# EasyEDA Pro project 电动自行车定位监测终端_v0.0.0.epro

# Schematic Schematic1

## Sheets
1 MCU: Create Date: 2023-08-31; Page Name: MCU; Project Name: 电动自行车定位监测终端; Schematic Name: Schematic1; Update Date: 2023-08-31; Company: 嘉立创EDA; Page Size: A4; Version: V1.0
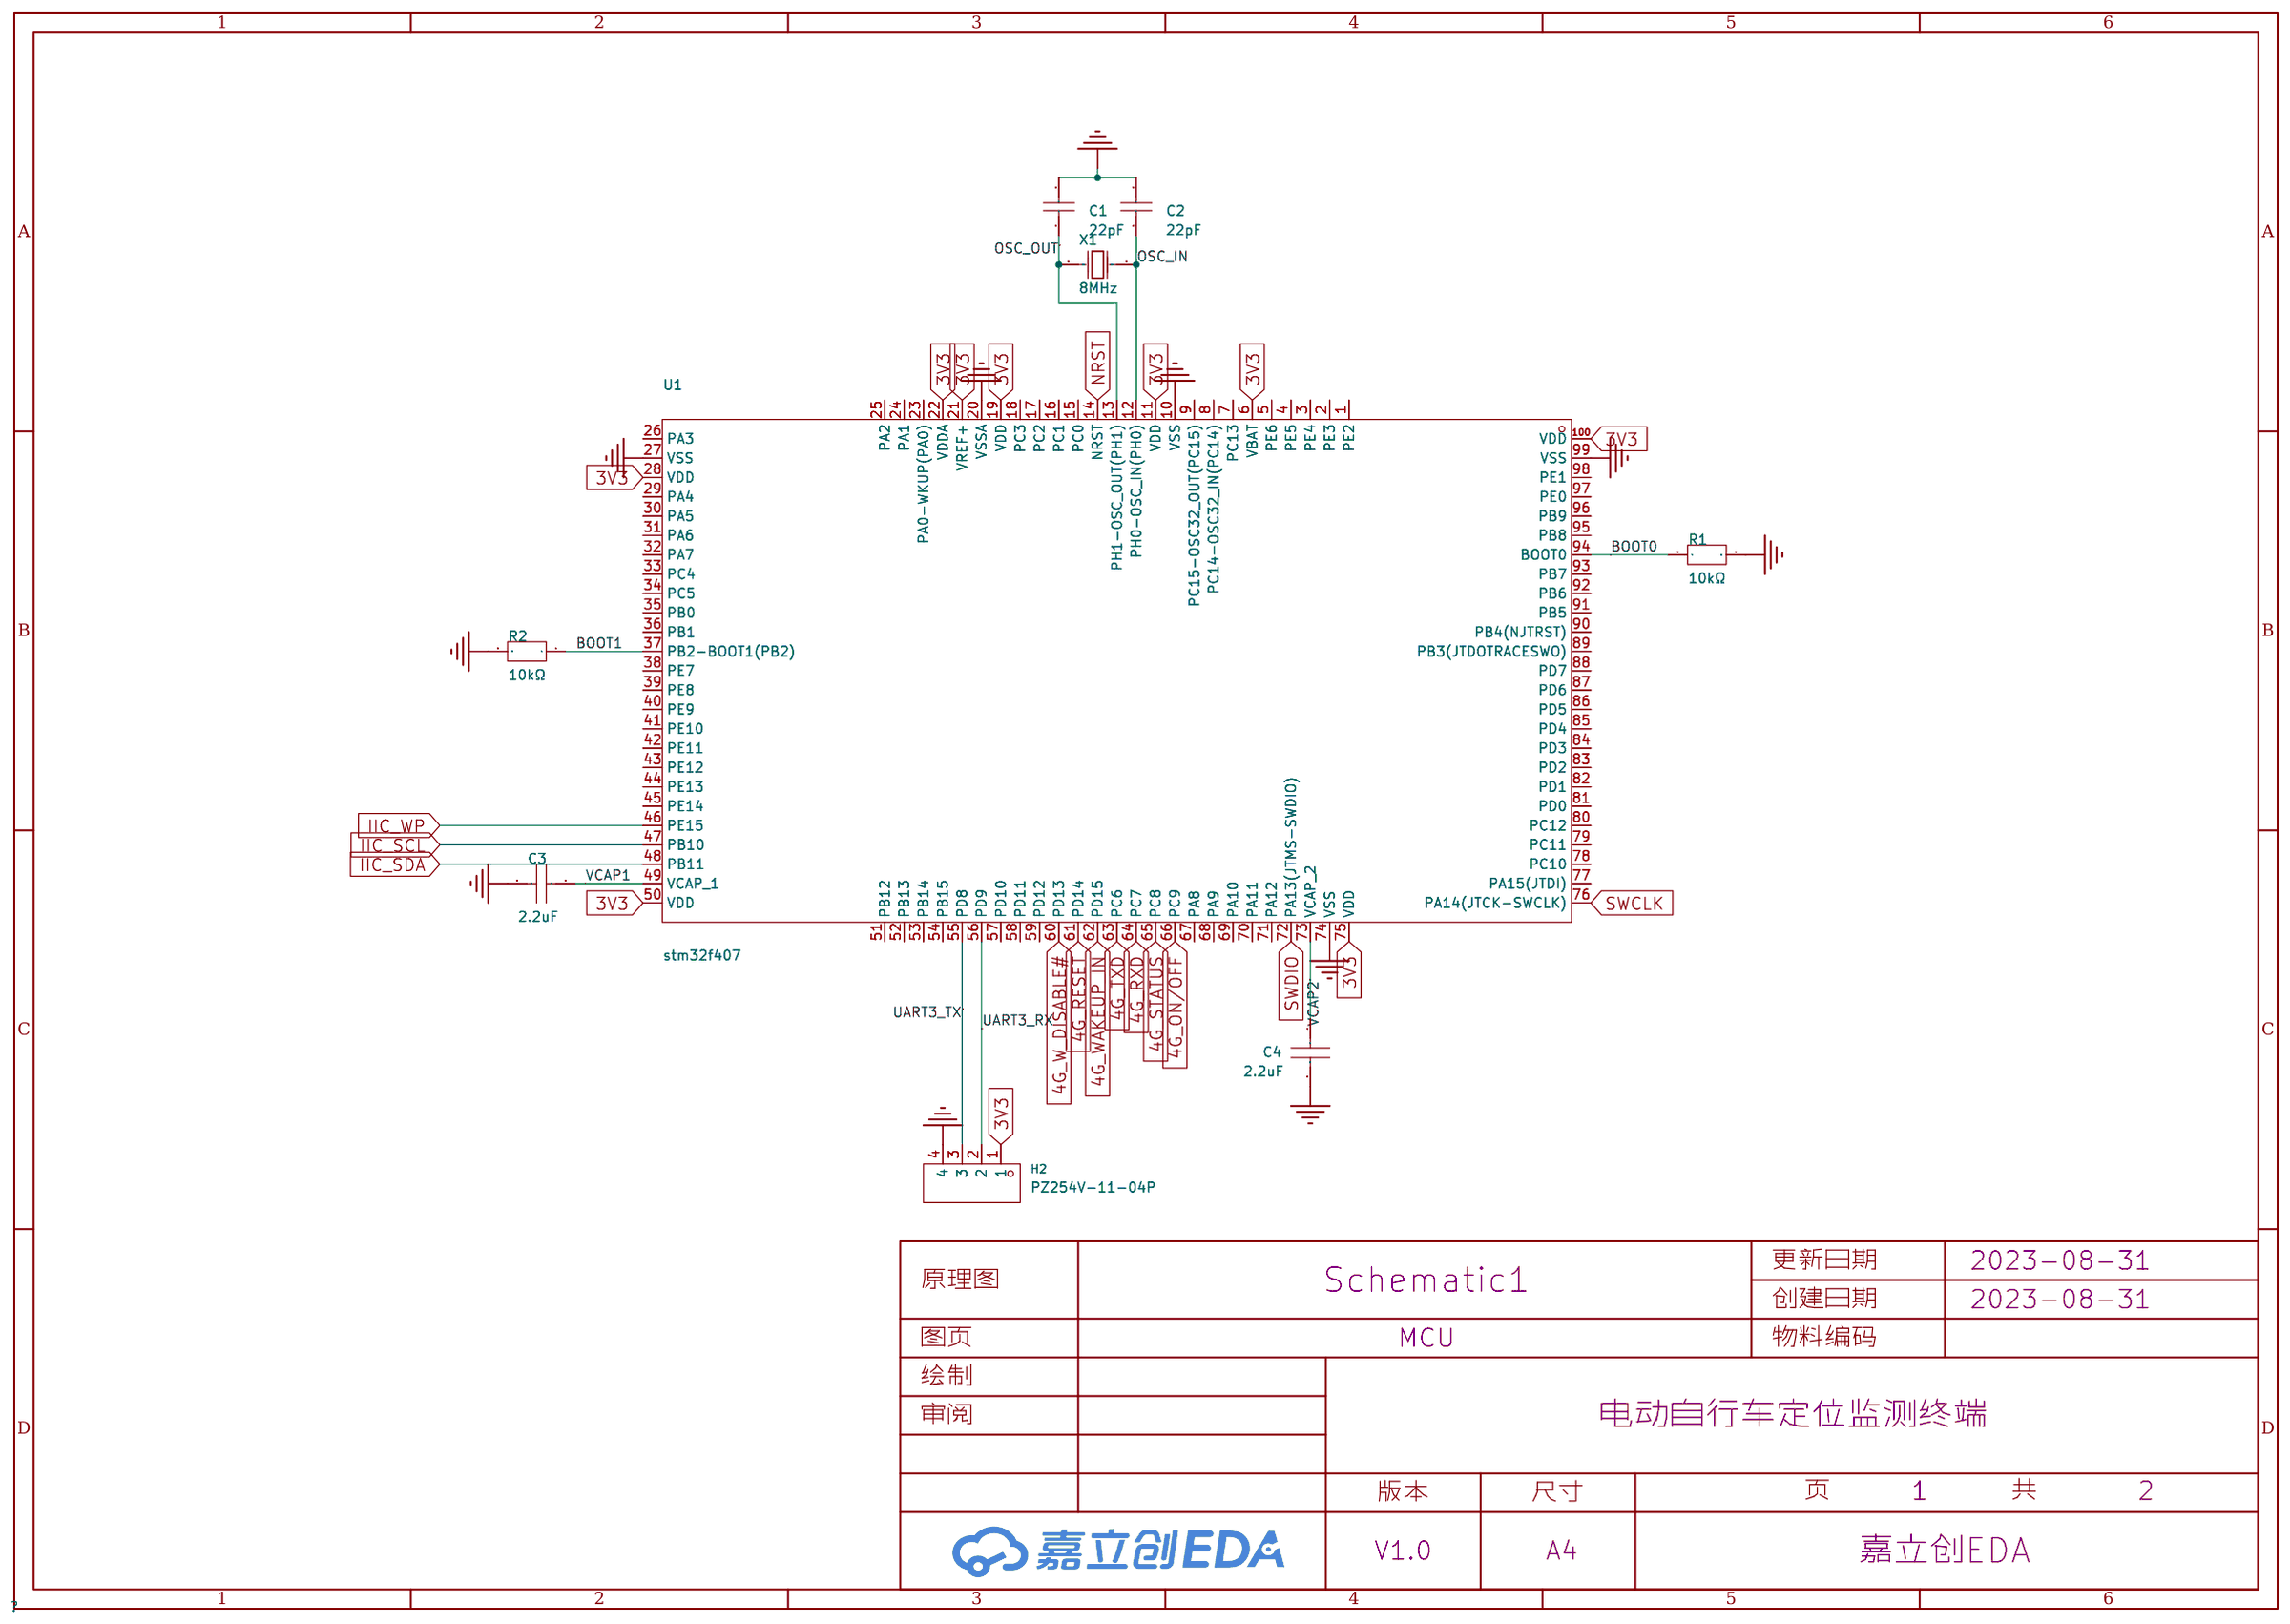
[diagram p0: MCU]
2 功能 模块: Page Name: 功能 模块
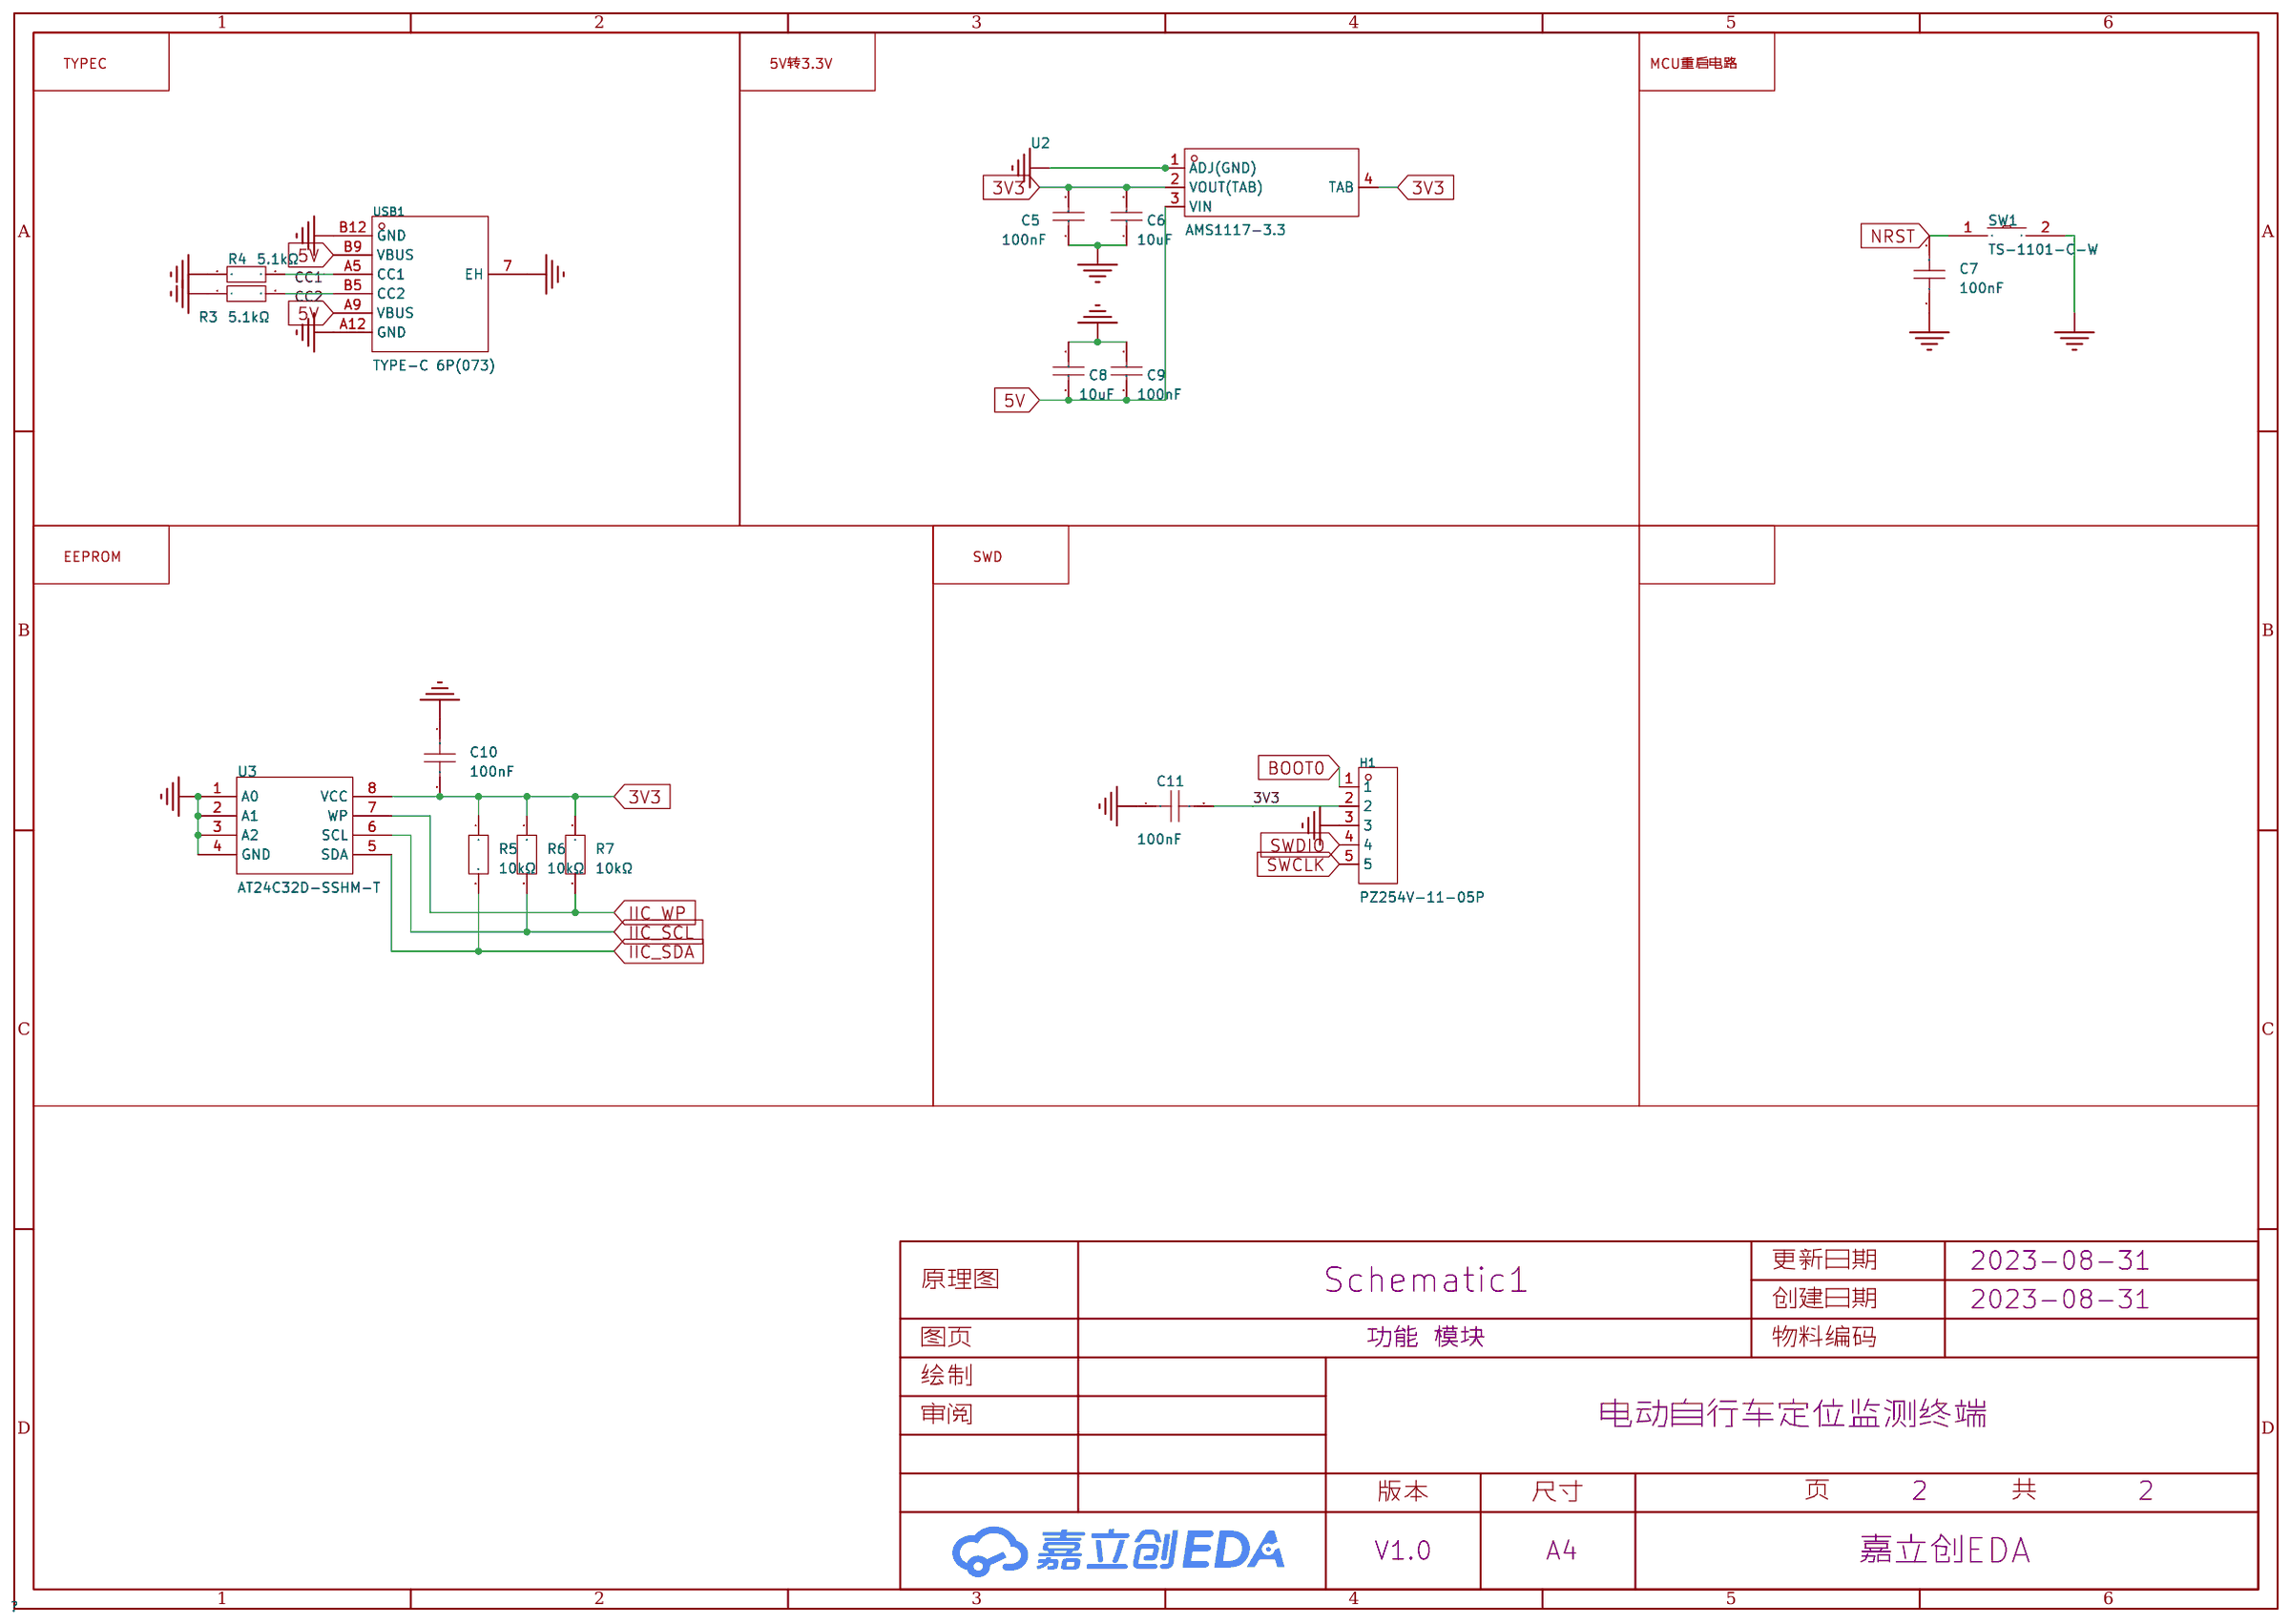
[diagram p1: 功能 模块]
3 4G主控芯片: Create Date: 2023-09-01; Page Name: 4G主控芯片; Update Date: 2023-09-01
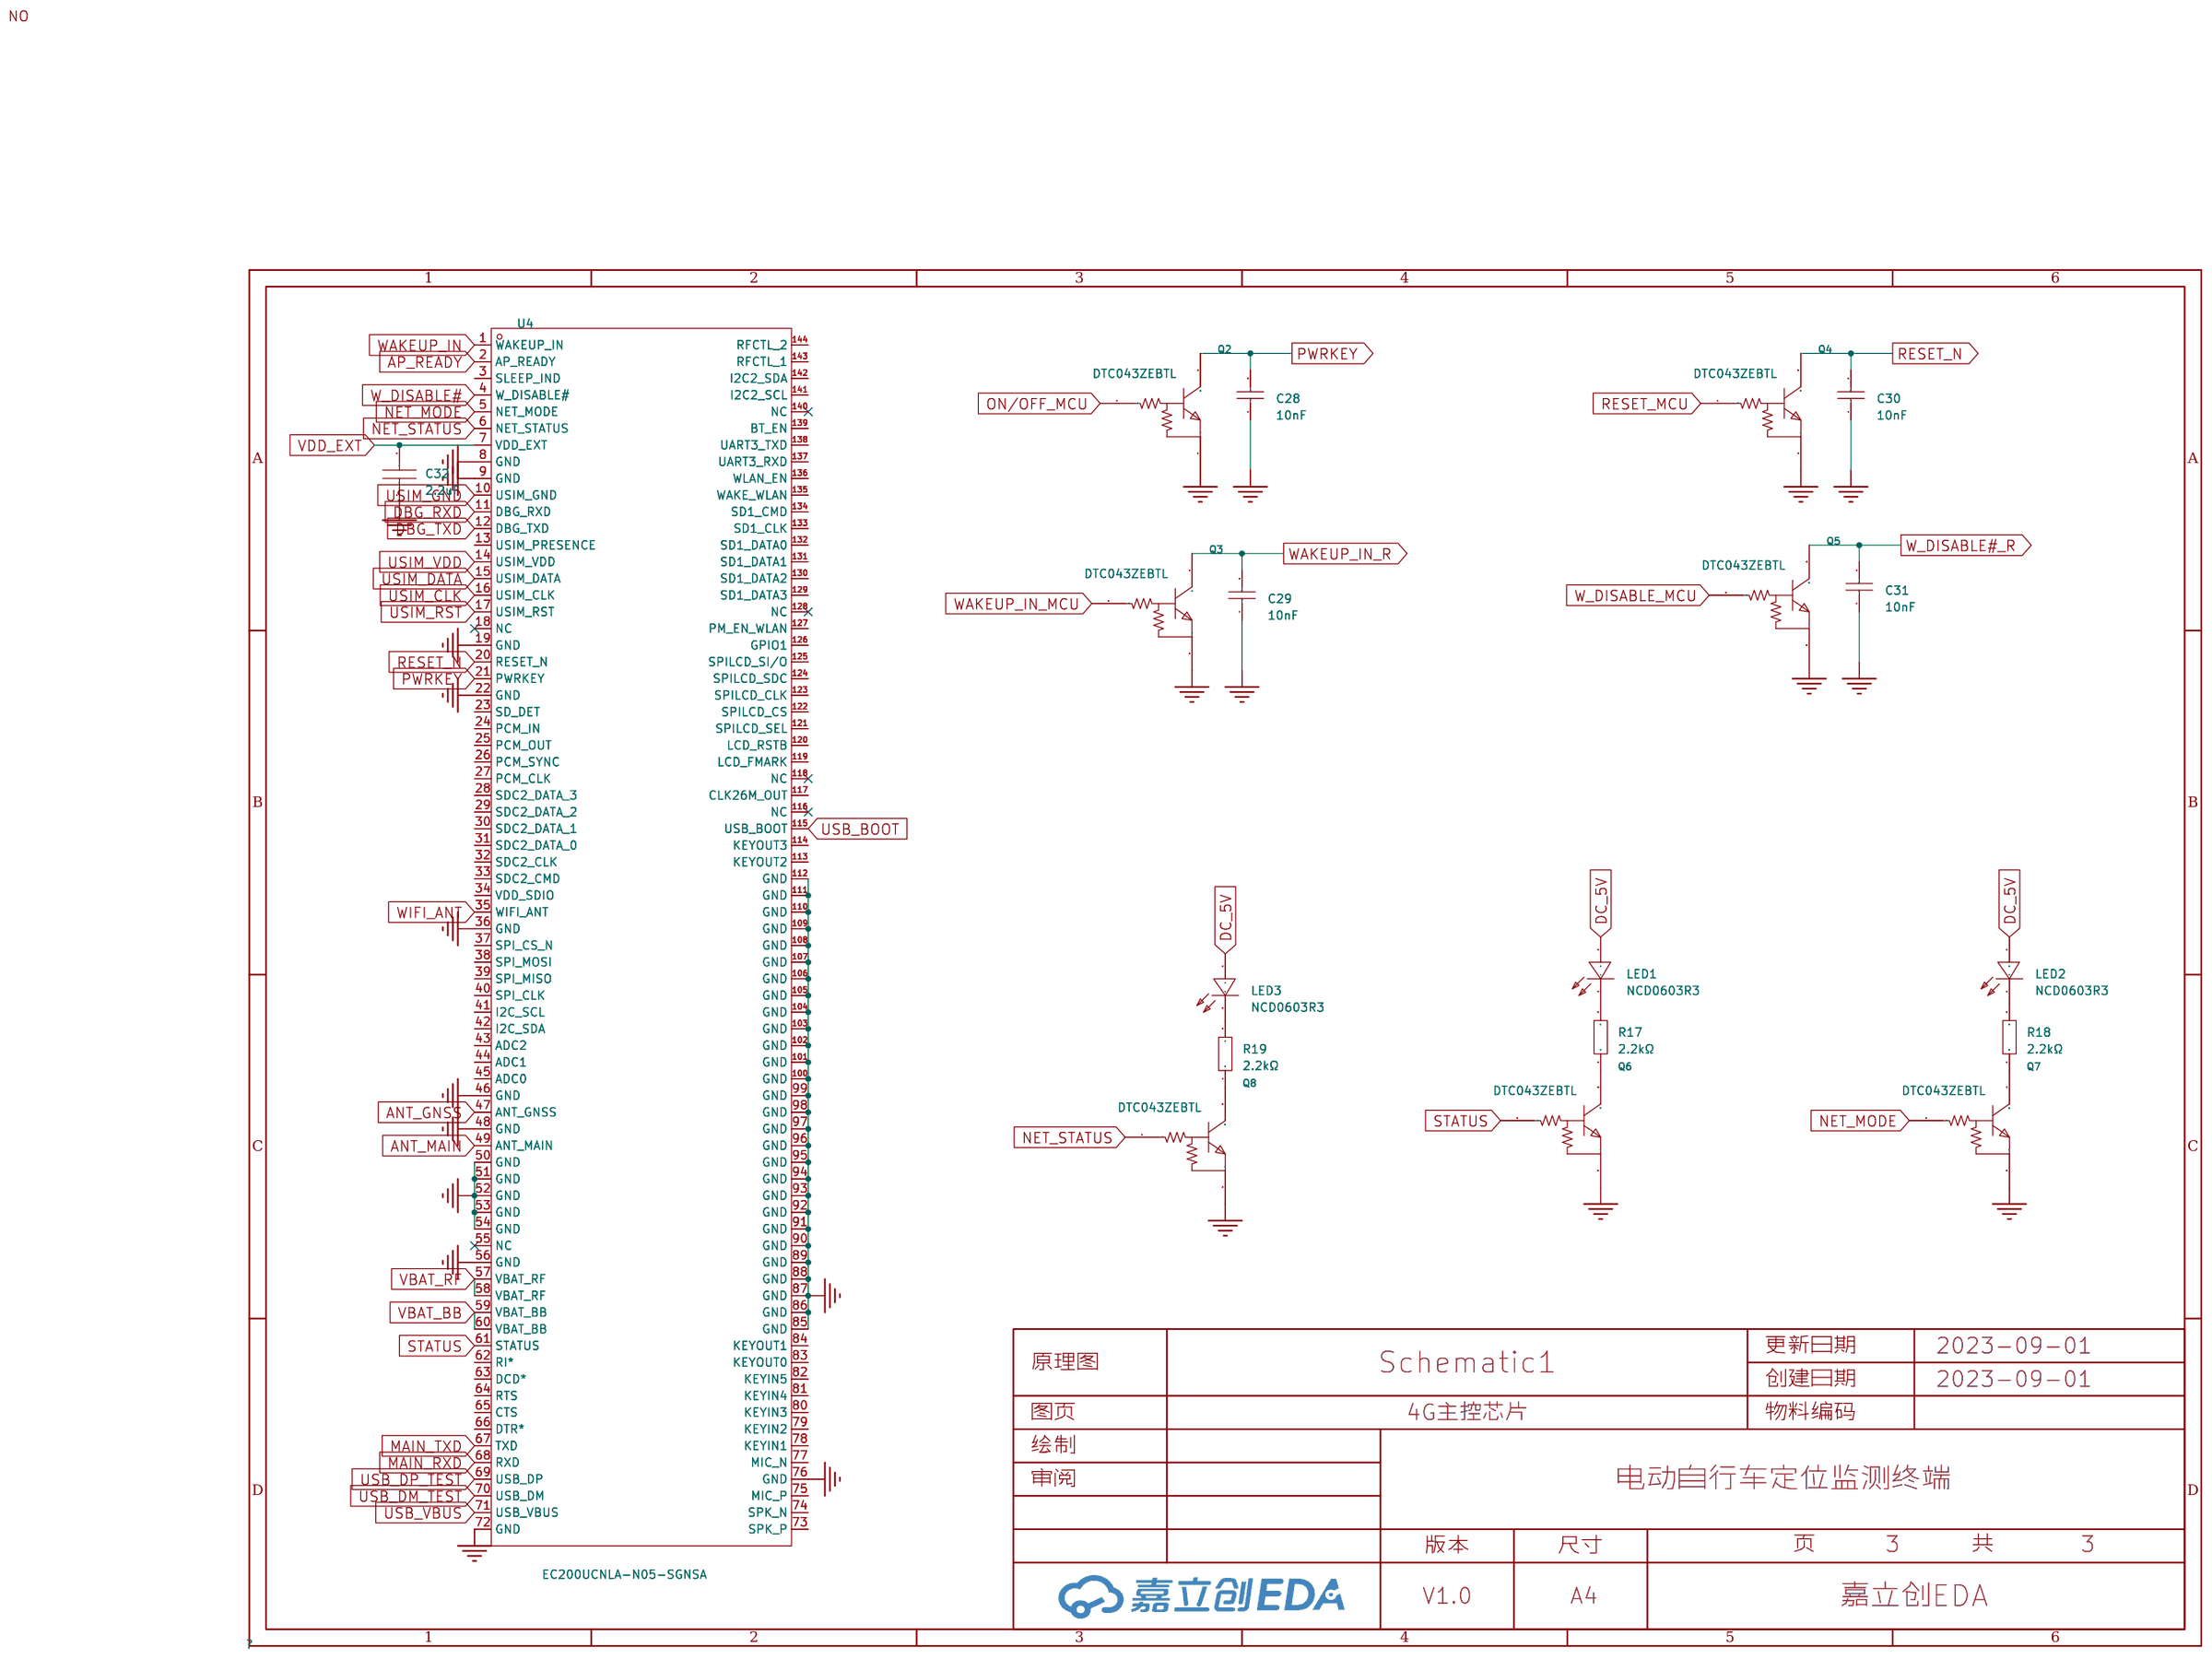
[diagram p2: 4G主控芯片]
4 4G外围模块: Create Date: 2023-09-01; Page Name: 4G外围模块; Update Date: 2023-09-01
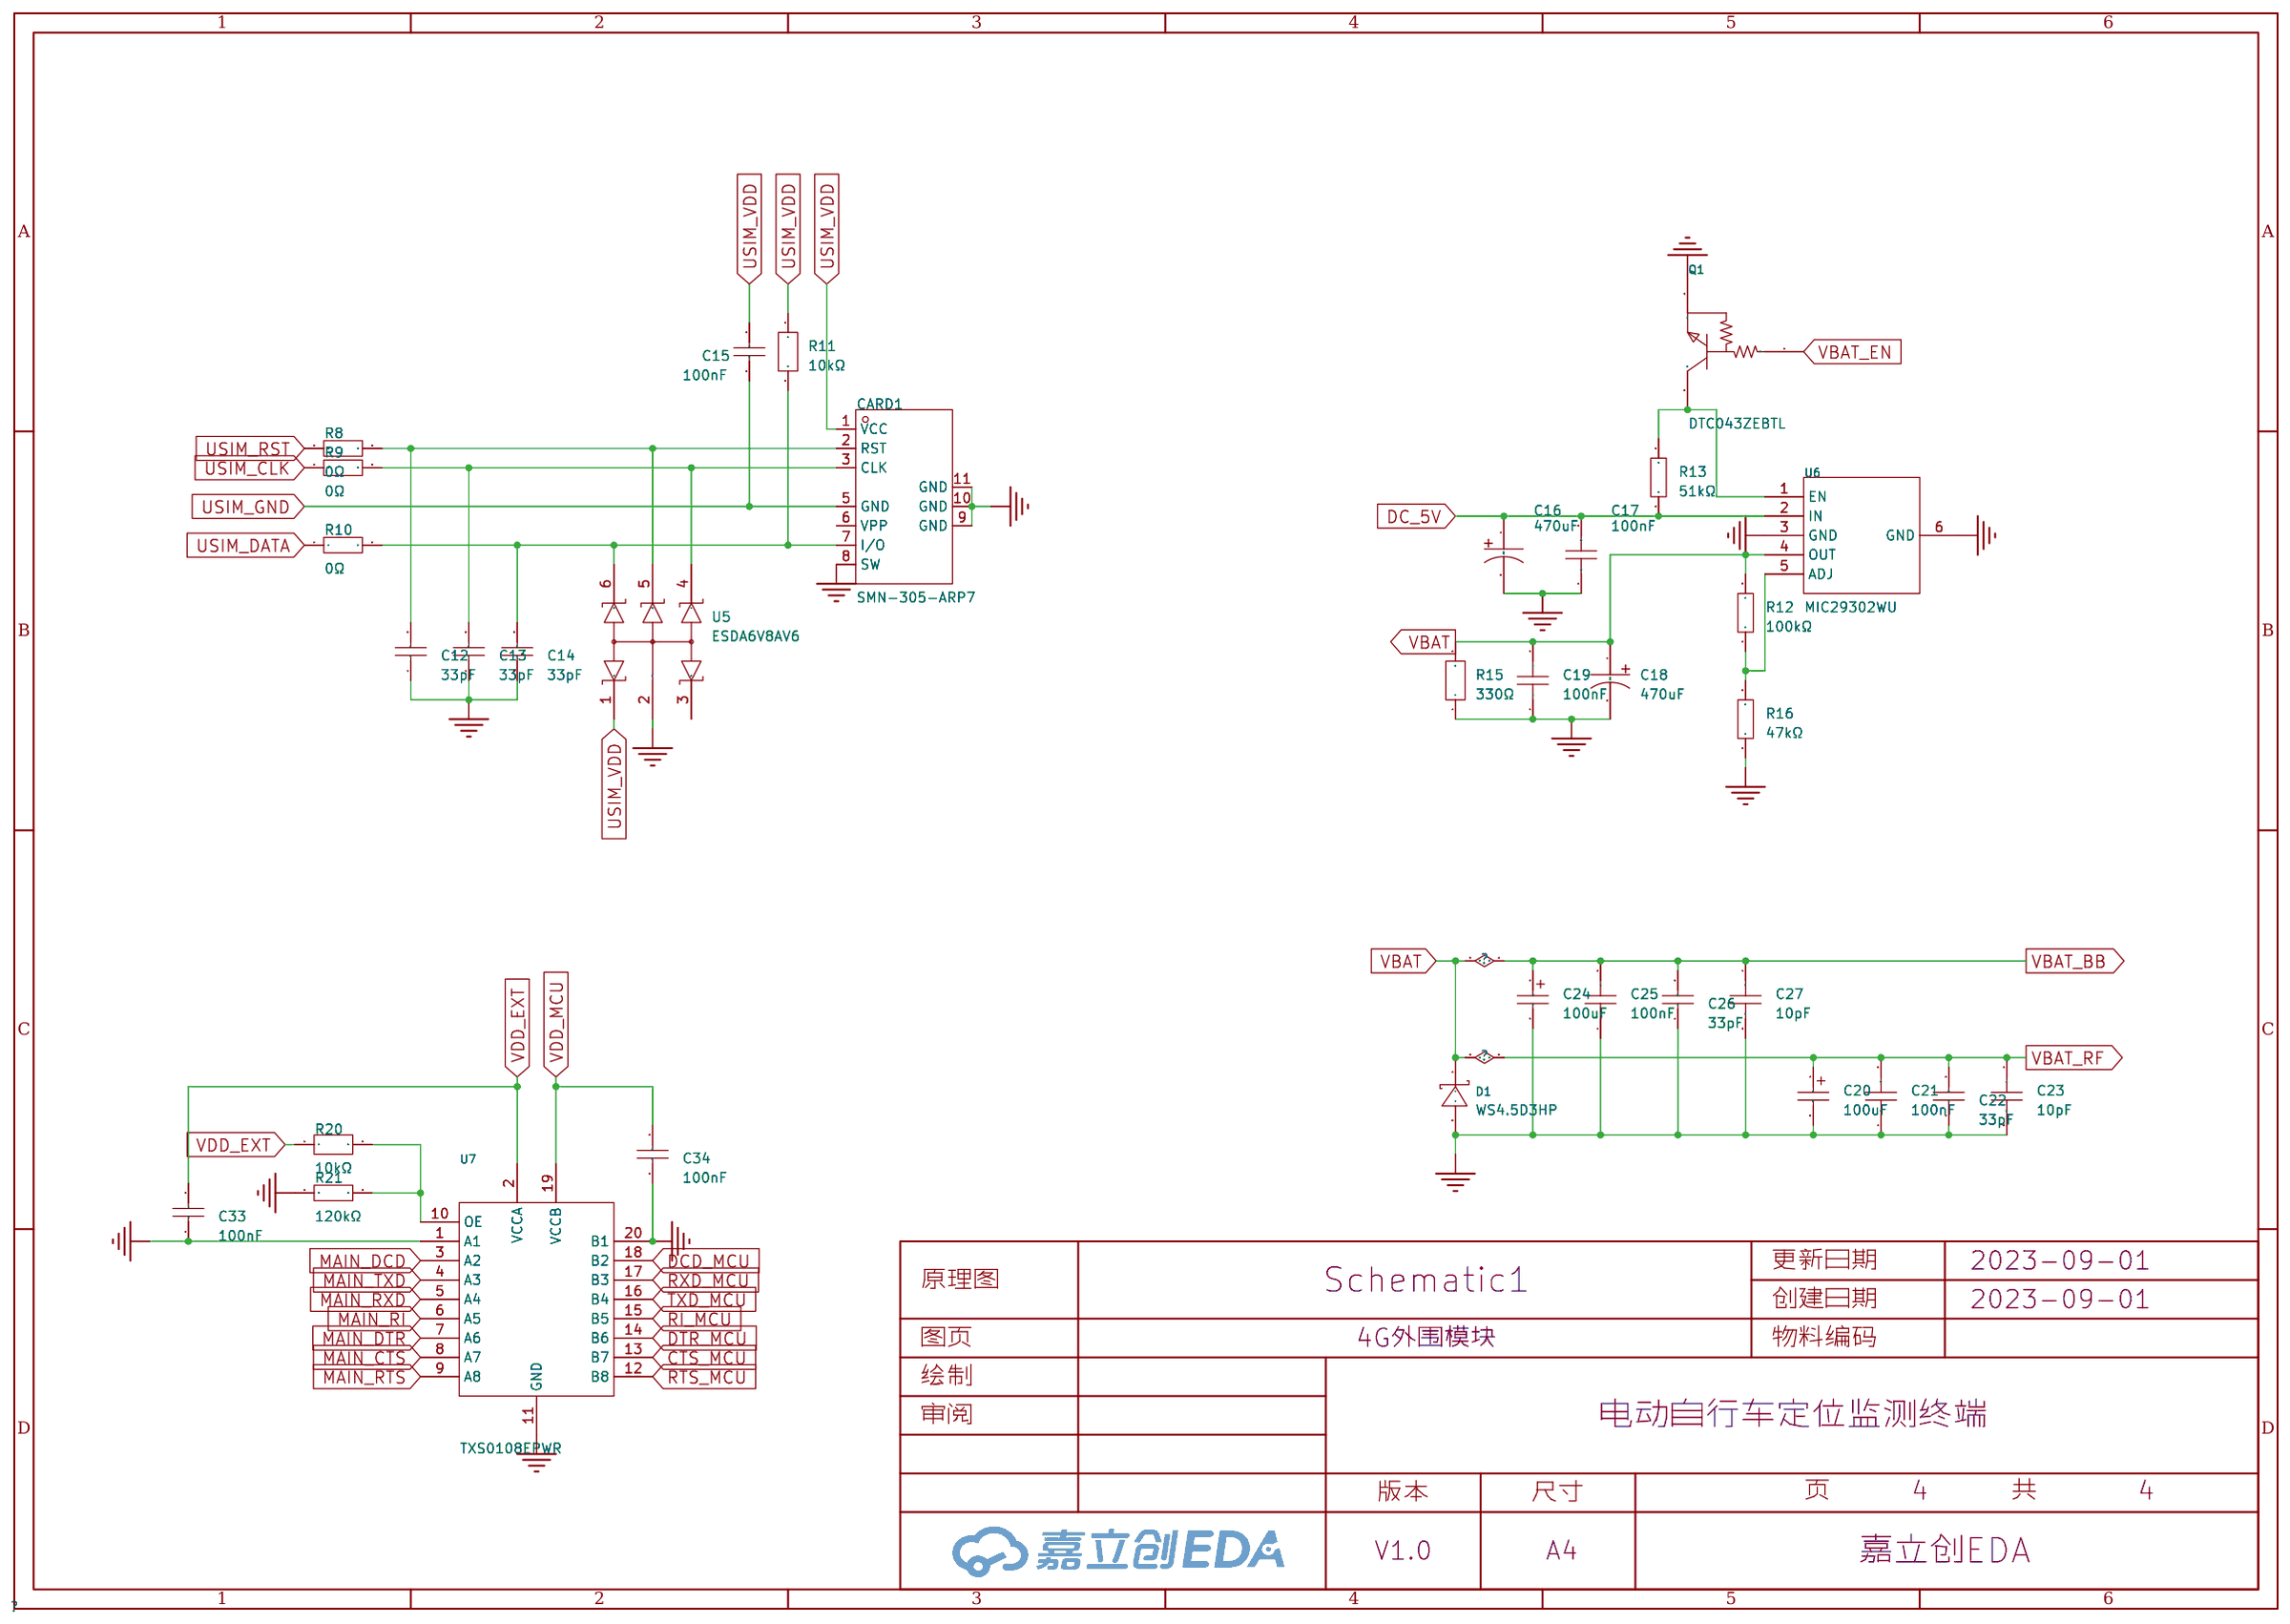
[diagram p3: 4G外围模块]

## Parts
sheet 4G主控芯片
C28  10nF  [C0603]
C29  10nF  [C0603]
C30  10nF  [C0603]
C31  10nF  [C0603]
C32  2.2uF  [C0402]
LED1  NCD0603R3  [LED0603-R-RD_RED]
LED2  NCD0603R3  [LED0603-R-RD_RED]
LED3  NCD0603R3  [LED0603-R-RD_RED]
Q2  DTC043ZEBTL  [SOT-416_L1.6-W0.8-P1.00-LS1.6-BR]
Q3  DTC043ZEBTL  [SOT-416_L1.6-W0.8-P1.00-LS1.6-BR]
Q4  DTC043ZEBTL  [SOT-416_L1.6-W0.8-P1.00-LS1.6-BR]
Q5  DTC043ZEBTL  [SOT-416_L1.6-W0.8-P1.00-LS1.6-BR]
Q6  DTC043ZEBTL  [SOT-416_L1.6-W0.8-P1.00-LS1.6-BR]
Q7  DTC043ZEBTL  [SOT-416_L1.6-W0.8-P1.00-LS1.6-BR]
Q8  DTC043ZEBTL  [SOT-416_L1.6-W0.8-P1.00-LS1.6-BR]
R17  2.2kΩ  [R0603]
R18  2.2kΩ  [R0603]
R19  2.2kΩ  [R0603]
U4  EC200UCNLA-N05-SGNSA  [LCC-LGA-144_L31.0-W28.0-P1.30_L610-CN-02]
sheet 4G外围模块
C12  33pF  [C0402]
C13  33pF  [C0402]
C14  33pF  [C0402]
C15  100nF  [C0603]
C16  470uF  [CAP-SMD_L7.3-W4.3-FD-A]
C17  100nF  [C01005]
C18  470uF  [CAP-SMD_L7.3-W4.3-FD-A]
C19  100nF  [C01005]
C20  100uF  [CAP-SMD_L6.0-W3.2-R-RD]
C21  100nF  [C01005]
C22  33pF  [C0402]
C23  10pF  [C0805]
C24  100uF  [CAP-SMD_L6.0-W3.2-R-RD]
C25  100nF  [C01005]
C26  33pF  [C0402]
C27  10pF  [C0805]
C33  100nF  [C0603]
C34  100nF  [C0603]
CARD1  SMN-305-ARP7  [NANO-SIM-SMD_SMN-305-ARP7]
D1  WS4.5D3HP  [SOD-323_L1.7-W1.3-LS2.5-RD-1]
Q1  DTC043ZEBTL  [SOT-416_L1.6-W0.8-P1.00-LS1.6-BR]
R8  0Ω  [R0603]
R9  0Ω  [R0603]
R10  0Ω  [R0603]
R11  10kΩ  [R0603]
R12  100kΩ  [R0603]
R13  51kΩ  [R0603]
R15  330Ω  [R0603]
R16  47kΩ  [R0603]
R20  10kΩ  [R0603]
R21  120kΩ  [R0402]
U5  ESDA6V8AV6  [SOT-563-6_L1.6-W1.2-P0.50-LS1.6-BL]
U6  MIC29302WU  [TO-263-5_L10.1-W8.7-P1.70-LS15.2-BR]
U7  TXS0108EPWR  [TSSOP-20_L6.5-W4.4-P0.65-LS6.4-BL]
sheet MCU
C1  22pF  [C0603]
C2  22pF  [C0603]
C3  2.2uF  [C0402]
C4  2.2uF  [C0402]
H2  PZ254V-11-04P  [HDR-TH_4P-P2.54-V-M]
R1  10kΩ  [R0603]
R2  10kΩ  [R0603]
U1  stm32f407  [LQFP-100_L14.0-W14.0-P0.50-LS16.0-BL]
X1  8MHz  [CRYSTAL-SMD_L5.0-W3.2]
sheet 功能 模块
C5  100nF  [C0603]
C6  10uF  [C0805]
C7  100nF  [C0201]
C8  10uF  [C0805]
C9  100nF  [C0603]
C10  100nF  [C0201]
C11  100nF  [C0201]
H1  PZ254V-11-05P  [HDR-TH_5P-P2.54-V-M]
R3  5.1kΩ  [R0603]
R4  5.1kΩ  [R0603]
R5  10kΩ  [R0603]
R6  10kΩ  [R0603]
R7  10kΩ  [R0603]
SW1  TS-1101-C-W  [SW-SMD_L6.0-W3.3-LS8.0]
U2  AMS1117-3.3  [SOT-223-4_L6.5-W3.5-P2.30-LS7.0-BR]
U3  AT24C32D-SSHM-T  [SOIC-8_L5.0-W4.0-P1.27-LS6.0-BL]
USB1  TYPE-C 6P(073)  [TYPE-C-SMD_TYPE-C-6P]

## Library data of the parts
C28-C31 = CC0603KRX7R9BB103: 容值:10nF;精度:±10%;额定电压:50V;材质(温度系数):X7R;; LCSC Part Name: 10nF ±10% 50V; Supplier Part: C100042; Manufacturer: YAGEO(国巨); Supplier Footprint: 0603; Datasheet: https://atta.szlcsc.com/upload/public/pdf/source/20180326/C100042_E8B0111D51DE3671A0A4A59FBCEFE81C.pdf; Supplier: LCSC; Tolerance: ±10%; Voltage Rated: 50V; Temperature Coefficient: X7R
C3 C4 C32 = CL05A225MQ5NSNC: 容值:2.2uF;精度:±20%;额定电压:6.3V;材质(温度系数):X5R;; LCSC Part Name: 2.2uF ±20% 6.3V; Supplier Part: C12530; Manufacturer: SAMSUNG(三星); Supplier Footprint: 0402; Datasheet: https://atta.szlcsc.com/upload/public/pdf/source/20160103/1457707666860.pdf; Supplier: LCSC; Tolerance: ±20%; Voltage Rated: 6.3V; Temperature Coefficient: X5R
LED1-LED3 = NCD0603R3: 尺寸1.6x0.8x0.8；IF=20ma：1.6~2.6v，620~640nm,51~150mcd金线，光强高，功耗低，可靠性好，寿命长; LCSC Part Name: 红色;贴片LED;0603红灯;; Supplier Part: C3151730; Manufacturer: 国星光电; Supplier Footprint: 0603; Datasheet: https://atta.szlcsc.com/upload/public/pdf/source/20220704/CBFF28C1847A97213A75929E60B7DDE7.pdf; Supplier: LCSC
Q1-Q8 = DTC043ZEBTL: 晶体管类型:1个NPN-预偏置;功率(Pd):150mW;集电极电流(Ic):100mA;集射极击穿电压(Vceo):50V;; LCSC Part Name: 1个NPN-预偏置 100mA 50V; Supplier Part: C96459; Manufacturer: ROHM(罗姆); Supplier Footprint: SOT-416FL; Supplier: LCSC; Transistor Type: 1个NPN-预偏置; Power Dissipation (Pd): 150mW; Collector Current (Ic): 100mA; Collector-Emitter Breakdown Voltage (Vceo): 50V
R17-R19 = 0603WAF2201T5E: 电阻类型:厚膜电阻;阻值:2.2kΩ;精度:±1%;功率:100mW;; LCSC Part Name: 2.2kΩ ±1% 100mW; Supplier Part: C4190; Manufacturer: UNI-ROYAL(厚声); Supplier Footprint: 0603; Datasheet: https://atta.szlcsc.com/upload/public/pdf/source/20200306/C422600_1E6D84923E4A46A82E41ADD87F860B5C.pdf; Supplier: LCSC; Type: 厚膜电阻; Tolerance: ±1%; Power(Watts): 100mW; Temperature Coefficient: ±100ppm/℃; Overload Voltage (Max): 75V; Operating Temperature Range: -55℃~+155℃
U4 = EC200UCNLA-N05-SGNSA: LCSC Part Name: LTE Cat 1模块; Supplier Part: C2916206; Manufacturer: Quectel(移远); Supplier Footprint: SMD,28x31mm; Datasheet: https://atta.szlcsc.com/upload/public/pdf/source/20220309/3C2078D3551E384BF180A9D9DC9FCCD3.pdf; Supplier: LCSC
C12-C14 C22 C26 = CC0402JRNPO9BN330: 容值:33pF;精度:±5%;额定电压:50V;材质(温度系数):NP0;; LCSC Part Name: 33pF ±5% 50V; Supplier Part: C107005; Manufacturer: YAGEO(国巨); Supplier Footprint: 0402; Datasheet: https://atta.szlcsc.com/upload/public/pdf/source/20171026/C107005_15089856307561059550.pdf; Supplier: LCSC; Tolerance: ±5%; Voltage Rated: 50V; Temperature Coefficient: NP0
C5 C9 C15 C33 C34 = 0603B104K500NT: 容值:100nF;精度:±10%;额定电压:50V;材质(温度系数):X7R;; LCSC Part Name: 100nF ±10% 50V; Supplier Part: C30926; Manufacturer: FH(风华); Supplier Footprint: 0603; Datasheet: https://atta.szlcsc.com/upload/public/pdf/source/20170923/C30926_1506149436298988724.pdf; Supplier: LCSC; Tolerance: ±10%; Voltage Rated: 50V; Temperature Coefficient: X7R
C16 C18 = EEFSX0E471E4: 容值:470uF;精度:±20%;额定电压:2.5V;纹波电流:-;等效串联电阻:-;; LCSC Part Name: 470uF ±20% 2.5V; Supplier Part: C402830; Manufacturer: PANASONIC(松下); Supplier Footprint: SMD,4.3x7.3mm; Datasheet: https://atta.szlcsc.com/upload/public/pdf/source/20190712/C402830_67947BD3BF54E142E70C28D0151D2A50.pdf; Supplier: LCSC; Tolerance: ±20%; Rated Voltage: 2.5V; Lifetime @ Temp: 2000hrs@105℃; Operating Temperature: -45℃~+105℃
C17 C19 C21 C25 = GRM022R60J104KE15D: 容值:100nF;精度:±10%;额定电压:6.3V;材质(温度系数):X5R;; LCSC Part Name: 100nF ±10% 6.3V; Supplier Part: C161362; Manufacturer: muRata(村田); Supplier Footprint: 01005; Datasheet: https://atta.szlcsc.com/upload/public/pdf/source/20180516/C161362_D84A9F9EF969DBF4536B577225C921A0.pdf; Supplier: LCSC; Tolerance: ±10%; Voltage Rated: 6.3V; Temperature Coefficient: X5R
C20 C24 = TAJC107K016RNJ: 容值:100uF;精度:±10%;额定电压:16V;等效串联电阻:1Ω@100kHz;; LCSC Part Name: 100uF ±10% 16V; Supplier Part: C11375; Manufacturer: Kyocera AVX; Supplier Footprint: CASE-C-6032; Datasheet: https://atta.szlcsc.com/upload/public/pdf/source/20160107/1457707745207.pdf; Supplier: LCSC; Tolerance: ±10%; Rated Voltage: 16V; Equivalent Series Resistance(ESR): 1Ω@100kHz; Operating Temperature: -55℃~+125℃
C23 C27 = 0805CG100J500NT: 容值:10pF;精度:±5%;额定电压:50V;材质(温度系数):C0G;; LCSC Part Name: 10pF ±5% 50V; Supplier Part: C157608; Manufacturer: FH(风华); Supplier Footprint: 0805; Datasheet: https://atta.szlcsc.com/upload/public/pdf/source/20171221/C157608_15138397142581196117.pdf; Supplier: LCSC; Tolerance: ±5%; Voltage Rated: 50V; Temperature Coefficient: C0G
CARD1 = SMN-305-ARP7: 卡连接方式:翻盖式;卡类型:NanoSIM卡;连接器类型:卡座;本体最大高度:1.4mm;触头材质:C5191;触头镀层:金;工作温度范围:-25℃~+85℃;焊接温度(最大值):260℃;; LCSC Part Name: 翻盖式 NanoSIM卡 卡座 6+1; Supplier Part: C720512; Manufacturer: XUNPU(讯普); Supplier Footprint: SMD; Datasheet: https://atta.szlcsc.com/upload/public/pdf/source/20210906/1E62678A42BE1E594705537ECE0FD854.pdf; Supplier: LCSC; Card Connection Mode: 翻盖式; Card Type: NanoSIM卡; Connector Type: 卡座; Body Height (Max): 1.4mm; Contact Material: C5191; Contact Plating: 金; Operating Temperature Range: -25℃~+85℃; Welding Temperature (Max): 260℃
D1 = WS4.5D3HP: LCSC Part Name: TVS; Supplier Part: C702915; Manufacturer: Wayon(上海维安); Supplier Footprint: SOD-323F; Datasheet: https://atta.szlcsc.com/upload/public/pdf/source/20200713/C702915_73E3FF0C45A3E2C092214FD6A9A28699.pdf; Supplier: LCSC
R8-R10 = 0603WAF0000T5E: 电阻类型:厚膜电阻;阻值:0Ω;精度:±1%;功率:100mW;; LCSC Part Name: 0Ω ±1% 100mW; Supplier Part: C21189; Manufacturer: UNI-ROYAL(厚声); Supplier Footprint: 0603; Datasheet: https://atta.szlcsc.com/upload/public/pdf/source/20200306/C422600_1E6D84923E4A46A82E41ADD87F860B5C.pdf; Supplier: LCSC; Type: 厚膜电阻; Tolerance: ±1%; Power(Watts): 100mW; Overload Voltage (Max): 75V; Operating Temperature Range: -55℃~+155℃
R1 R2 R5-R7 R11 R20 = AT0603BRD0710KL: 电阻类型:薄膜电阻;阻值:10kΩ;精度:±0.1%;功率:100mW;; LCSC Part Name: 10kΩ ±0.1% 100mW; Supplier Part: C723396; Manufacturer: YAGEO(国巨); Supplier Footprint: 0603; JLCPCB Part Class: 扩展库; Datasheet: https://atta.szlcsc.com/upload/public/pdf/source/20200722/C705051_EA338A836C78FCD1C867566BE6F43B3A.pdf; Supplier: LCSC; Type: 薄膜电阻; Tolerance: ±0.1%; Power(Watts): 100mW; Temperature Coefficient: ±25ppm/℃; Overload Voltage (Max): 75V; Operating Temperature Range: -55℃~+155℃
R12 = RC0603FR-07100KL: 电阻类型:厚膜电阻;阻值:100kΩ;精度:±1%;功率:100mW;; LCSC Part Name: 100kΩ ±1% 100mW; Supplier Part: C14675; Manufacturer: YAGEO(国巨); Supplier Footprint: 0603; Datasheet: https://atta.szlcsc.com/upload/public/pdf/source/20140324/1457707028752.pdf; Supplier: LCSC; Type: 厚膜电阻; Tolerance: ±1%; Power(Watts): 100mW; Temperature Coefficient: ±100ppm/℃; Overload Voltage (Max): 75V; Operating Temperature Range: -55℃~+155℃
R13 = 0603WAF5102T5E: 电阻类型:厚膜电阻;阻值:51kΩ;精度:±1%;功率:100mW;; LCSC Part Name: 51kΩ ±1% 100mW; Supplier Part: C23196; Manufacturer: UNI-ROYAL(厚声); Supplier Footprint: 0603; Datasheet: https://atta.szlcsc.com/upload/public/pdf/source/20200306/C422600_1E6D84923E4A46A82E41ADD87F860B5C.pdf; Supplier: LCSC; Type: 厚膜电阻; Tolerance: ±1%; Power(Watts): 100mW; Temperature Coefficient: ±100ppm/℃; Overload Voltage (Max): 75V; Operating Temperature Range: -55℃~+155℃
R15 = AR03BTB3300: 电阻类型:薄膜电阻;阻值:330Ω;精度:±0.1%;功率:62.5mW;; LCSC Part Name: 330Ω ±0.1% 62.5mW; Supplier Part: C408915; Manufacturer: Viking(光颉); Supplier Footprint: 0603; Datasheet: https://atta.szlcsc.com/upload/public/pdf/source/20190730/C408915_884B1C323727C98373DF4AB5D2928F82.pdf; Supplier: LCSC; Type: 薄膜电阻; Tolerance: ±0.1%; Power(Watts): 62.5mW; Temperature Coefficient: ±10ppm/℃; Overload Voltage (Max): 50V; Operating Temperature Range: -55℃~+155℃
R16 = 0603WAF4702T5E: 电阻类型:厚膜电阻;阻值:47kΩ;精度:±1%;功率:100mW;; LCSC Part Name: 47kΩ ±1% 100mW; Supplier Part: C25819; Manufacturer: UNI-ROYAL(厚声); Supplier Footprint: 0603; Datasheet: https://atta.szlcsc.com/upload/public/pdf/source/20200306/C422600_1E6D84923E4A46A82E41ADD87F860B5C.pdf; Supplier: LCSC; Type: 厚膜电阻; Tolerance: ±1%; Power(Watts): 100mW; Temperature Coefficient: ±100ppm/℃; Overload Voltage (Max): 75V; Operating Temperature Range: -55℃~+155℃
R21 = 0402WGF1203TCE: 电阻类型:厚膜电阻;阻值:120kΩ;精度:±1%;功率:62.5mW;; LCSC Part Name: 120kΩ ±1% 62.5mW; Supplier Part: C25750; Manufacturer: UNI-ROYAL(厚声); Supplier Footprint: 0402; JLCPCB Part Class: 基础库; Datasheet: https://atta.szlcsc.com/upload/public/pdf/source/20200306/C422600_1E6D84923E4A46A82E41ADD87F860B5C.pdf; Supplier: LCSC; Type: 厚膜电阻; Tolerance: ±1%; Power(Watts): 62.5mW; Temperature Coefficient: ±100ppm/℃; Overload Voltage (Max): 50V; Operating Temperature Range: -55℃~+155℃
U5 = ESDA6V8AV6: Supplier Part: C3021131; Manufacturer: TECH PUBLIC(台舟); Supplier Footprint: SOT-563; Datasheet: https://atta.szlcsc.com/upload/public/pdf/source/20220602/7DAC70CE9F6509F28726B722709467C3.pdf; Supplier: LCSC
U6 = MIC29302WU: LCSC Part Name: 3A Fast-Response LDO Regulator; Supplier Part: C2995533; Manufacturer: UMW(友台半导体); Supplier Footprint: TO-263; Supplier: LCSC
U7 = TXS0108EPWR: 电路数:1;每个电路通道数:8;电压(VCCA):1.4V~3.6V;电压(VCCB):1.65V~5.5V;数据速率:60Mbps;; LCSC Part Name: 60Mbps 8位双向电平转换器; Supplier Part: C17206; Manufacturer: TI(德州仪器); Supplier Footprint: TSSOP-20; Datasheet: http://www.ti.com/cn/lit/gpn/txs0108e; Supplier: LCSC; Channel Type: 双向; Number of Circuits: 1; Channels per Circuit: 8; Supply Voltage (VCCA): 1.4V~3.6V; Supply Voltage (VCCB): 1.65V~5.5V; Output Type: 开路漏极；推挽式; Data Rate: 60Mbps; Operating Temperature: -40℃~+85℃; Features: 自动方向检测
C1 C2 = CC0603JRNPO9BN220: 容值:22pF;精度:±5%;额定电压:50V;材质(温度系数):NP0;; LCSC Part Name: 22pF ±5% 50V; Supplier Part: C105620; Manufacturer: YAGEO(国巨); Supplier Footprint: 0603; Datasheet: https://atta.szlcsc.com/upload/public/pdf/source/20170425/1493115771353.pdf; Supplier: LCSC; Tolerance: ±5%; Voltage Rated: 50V; Temperature Coefficient: NP0
H2 = PZ254V-11-04P: 排数:单排;总PIN位数:4P;间距:2.54mm;插针结构:1x4P;行距:-;安装类型:直插;圆针/方针:方针;额定电流:3A;额定电压:250V;配合针长度:6mm;塑高:2.5mm;端接针长度:3mm;触头材质:-;工作温度范围:-40℃~+105℃;颜色:黑色;; LCSC Part Name: 2.54mm 1x4P 直插 方针; Supplier Part: C2691448; Manufacturer: XFCN(兴飞); Supplier Footprint: 插件,P=2.54mm; Datasheet: https://atta.szlcsc.com/upload/public/pdf/source/20200309/C492403_F9F19131791D08044AD4F84F8E751A34.pdf; Supplier: LCSC; Number of Rows: 单排; Number of Pins: 4P; Pitch: 2.54mm; Pin Structure: 1x4P; Mounting Type: 直插; Circluar Pins/Square Pins: 方针; Current Rating (Max): 3A; Voltage Rating (Max): 250V; Length of Mating Pin: 6mm; Insulation Height: 2.5mm; Length of End Connection Pin: 3mm; Operating Temperature Range: -40℃~+105℃; Color: 黑色
U1 = stm32f407: Supplier Part: C9900004365; Supplier Footprint: LQFP144-50P22X22X1.6; JLCPCB Part Class: 扩展库; Supplier: LCSC
X1 = X50328MSB2GI: 频率:8MHz;频率公差:±10ppm;负载电容:20pF;; LCSC Part Name: 8MHz ±10ppm 20pF YSX530GA YSX530GA; Supplier Part: C115962; Manufacturer: YXC(扬兴晶振); Supplier Footprint: SMD5032-2P; Datasheet: https://atta.szlcsc.com/upload/public/pdf/source/20230220/0EBFFB9D6D8CE6A211407822BBB6C516.pdf; Supplier: LCSC; Crystal Type: 贴片无源晶振; Frequency Tolerance: ±10ppm; Frequency Stability: ±50ppm; Load Capacitance: 20pF; Operating Temperature: -40℃~+85℃
C6 C8 = CL21A106KAYNNNE_C15850: 容值:10uF;精度:±10%;额定电压:25V;材质(温度系数):X5R;; LCSC Part Name: 10uF ±10% 25V; Supplier Part: C15850; Manufacturer: SAMSUNG(三星); Manufacturer Part: CL21A106KAYNNNE; Supplier Footprint: 0805; Datasheet: https://atta.szlcsc.com/upload/public/pdf/source/20160103/1457707679302.pdf; Supplier: LCSC; Tolerance: ±10%; Voltage Rated: 25V; Temperature Coefficient: X5R
C7 C10 C11 = C0201X5R104K160NT: 容值:100nF;精度:±10%;额定电压:16V;材质(温度系数):X5R;; LCSC Part Name: 100nF ±10% 16V; Supplier Part: C466601; Manufacturer: SANYEAR(叁叶源); Supplier Footprint: 0201; Datasheet: https://atta.szlcsc.com/upload/public/pdf/source/20191209/C466601_1F2E9E00AADD9CAB06FB62BCF57C4F08.pdf; Supplier: LCSC; Tolerance: ±10%; Voltage Rated: 16V; Temperature Coefficient: X5R
H1 = PZ254V-11-05P: 排数:单排;总PIN位数:5P;间距:2.54mm;插针结构:1x5P;行距:-;安装类型:直插;圆针/方针:方针;额定电流:-;额定电压:-;配合针长度:6mm;塑高:2.5mm;端接针长度:3mm;触头材质:黄铜;触头镀层:-;工作温度范围:-40℃~+105℃;颜色:黑色;; LCSC Part Name: 2.54mm 1x5P 直插 方针; Supplier Part: C492404; Manufacturer: XFCN(兴飞); Supplier Footprint: 插件,P=2.54mm; Datasheet: https://atta.szlcsc.com/upload/public/pdf/source/20200309/C492404_E51533260F8710EFF5D4617281164C1D.pdf; Supplier: LCSC; Number of Rows: 单排; Number of Pins: 5P; Pitch: 2.54mm; Pin Structure: 1x5P; Mounting Type: 直插; Circluar Pins/Square Pins: 方针; Length of Mating Pin: 6mm; Insulation Height: 2.5mm; Length of End Connection Pin: 3mm; Contact Material: 黄铜; Operating Temperature Range: -40℃~+105℃; Color: 黑色
R3 R4 = 0603WAF5101T5E: 电阻类型:厚膜电阻;阻值:5.1kΩ;精度:±1%;功率:100mW;; LCSC Part Name: 5.1kΩ ±1% 100mW; Supplier Part: C23186; Manufacturer: UNI-ROYAL(厚声); Supplier Footprint: 0603; JLCPCB Part Class: 基础库; Datasheet: https://atta.szlcsc.com/upload/public/pdf/source/20200306/C422600_1E6D84923E4A46A82E41ADD87F860B5C.pdf; Supplier: LCSC; Type: 厚膜电阻; Tolerance: ±1%; Power(Watts): 100mW; Temperature Coefficient: ±100ppm/℃; Overload Voltage (Max): 75V; Operating Temperature Range: -55℃~+155℃
SW1 = TS-1101-C-W: 触点电流:50mA;额定电压(AC):-;额定电压(DC):12V;额定功率:-;绝缘电阻:-;电路结构:单刀单掷;安装方式:立贴;带灯:无;作用力:260gf;机械寿命:5万次;带支架:否;; LCSC Part Name: 立贴 6*3.6*2.5mm 轻触开关 一型3*6*2.5有白ZD b拉伸白色带淡绿按键 卷装; Supplier Part: C318938; Manufacturer: XKB Connectivity(中国星坤); Supplier Footprint: SMD; JLCPCB Part Class: Extended Part; Datasheet: https://atta.szlcsc.com/upload/public/pdf/source/20200227/C318938_C2E53B1EEDE37D980A33616AC086DE53.pdf; Supplier: LCSC; Contact Current: 50mA; Voltage Rating (DC): 12V; Circuit: 单刀单掷; Mounting Style: 立贴; Actuator Style: 矩形按钮; Actuator/Cap Color: 白色带淡绿; With Lamp: 无; Operating Force: 260gf; Mechanical Life: 5万次; Operating Temperature: -30℃~+85℃; Switch Length: 6mm; Switch Width: 3.6mm; Switch Height: 2.5mm; Strike Gundam: 否
U2 = AMS1117-3.3_C347222: 输出类型:固定;输出极性:正;最大输入电压:18V;输出电压:3.3V;输出电流:1A;电源纹波抑制比(PSRR):60dB@(120Hz);; Supplier Part: C347222; Manufacturer: UMW(广东友台半导体); Supplier Footprint: SOT-223; Datasheet: https://atta.szlcsc.com/upload/public/pdf/source/20211011/50CC665C22E3A66C08379A4A74BDA25C.pdf; Supplier: LCSC; Output Type: 固定; Output Polarity: 正; Number of Outputs: 1; Maximum Input Voltage: 18V; Output Voltage: 3.3V; Dropout Voltage: 1.3V@(1A); Output Current: 1A; Power Supply Rejection Ratio (PSRR): 60dB@(120Hz)
U3 = AT24C32D-SSHM-T: 接口类型:I2C;存储容量:32Kbit;; Supplier Part: C60583; Manufacturer: MICROCHIP(美国微芯); Supplier Footprint: SOIC-8; Datasheet: https://atta.szlcsc.com/upload/public/pdf/source/20151012/1457707446205.pdf; Supplier: LCSC; Interface Type: I2C; Memory Size: 32Kbit; Supply Voltage: 1.7V~5.5V; Operating Temperature: -40℃~85℃
USB1 = TYPE-C 6P(073): 连接器类型:Type-C;标准:-;公母:母座;触点数量:6P;端口数量:1;安装方式:卧贴;额定电流 - 电源:5A;工作温度范围:-25℃~+85℃;; LCSC Part Name: Type-C 母座 卧贴; Supplier Part: C668623; Manufacturer: SHOU HAN(首韩); Supplier Footprint: SMD; JLCPCB Part Class: Extended Part; Datasheet: https://atta.szlcsc.com/upload/public/pdf/source/20200618/C668623_A4B260DED7AC1949BAC6AE39E9F4CD80.pdf; Supplier: LCSC; Connector Type: Type-C; Gender: 母座; Number of Contacts: 6P; Number of Ports: 1; Mounting Style: 卧贴; Current Rating - Power (Max): 5A; Operating Temperature Range: -25℃~+85℃

## Nets
3V3: C5.1 C6.1 C10.2 C11.2 H1.2 H2.1 R5.1 R6.1 R7.1 U1.6(VBAT) U1.11(VDD) U1.19(VDD) U1.21(VREF+) U1.22(VDDA) U1.28(VDD) U1.50(VDD) U1.75(VDD) U1.100(VDD) U2.2(VOUT(TAB)) U2.4(TAB) U3.8(VCC)
5V: C8.1 C9.1 U2.3(VIN) USB1.A9(VBUS) USB1.B9(VBUS)
GND: C1.1 C2.1 C3.2 C4.2 C5.2 C6.2 C7.1 C8.2 C9.2 C10.1 C11.1 C12.1 C13.1 C14.1 C16.2 C17.1 C18.2 C19.1 C20.2 C21.1 C22.1 C23.2 C24.2 C25.1 C26.1 C27.2 C28.1 C29.1 C30.1 C31.1 C32.1 C33.1 C34.1 CARD1.8(SW) CARD1.9(GND) CARD1.10(GND) CARD1.11(GND) D1.2(A) H1.3 H2.4 Q1.2(E) Q2.2(E) Q3.2(E) Q4.2(E) Q5.2(E) Q6.2(E) Q7.2(E) Q8.2(E) R1.2 R2.2 R3.1 R4.2 R15.1 R16.1 R21.1 SW1.2 U1.10(VSS) U1.20(VSSA) U1.27(VSS) U1.74(VSS) U1.99(VSS) U2.1(ADJ(GND)) U3.1(A0) U3.2(A1) U3.3(A2) U3.4(GND) U4.8(GND) U4.9(GND) U4.19(GND) U4.22(GND) U4.36(GND) U4.46(GND) U4.48(GND) U4.50(GND) U4.51(GND) U4.52(GND) U4.53(GND) U4.54(GND) U4.56(GND) U4.72(GND) U4.76(GND) U4.85(GND) U4.86(GND) U4.87(GND) U4.88(GND) U4.89(GND) U4.90(GND) U4.91(GND) U4.92(GND) U4.93(GND) U4.94(GND) U4.95(GND) U4.96(GND) U4.97(GND) U4.98(GND) U4.99(GND) U4.100(GND) U4.101(GND) U4.102(GND) U4.103(GND) U4.104(GND) U4.105(GND) U4.106(GND) U4.107(GND) U4.108(GND) U4.109(GND) U4.110(GND) U4.111(GND) U4.112(GND) U5.2 U6.3(GND) U6.6(GND) U7.1(A1) U7.11(GND) U7.20(B1) USB1.7(EH) USB1.A12(GND) USB1.B12(GND)
VBAT: C18.1 C19.2 C20.1 C21.2 C22.2 C23.1 C24.1 C25.2 C26.2 C27.1 D1.1(K) R12.2 R15.2 U4.57(VBAT_RF) U4.58(VBAT_RF) U4.59(VBAT_BB) U4.60(VBAT_BB) U6.4(OUT)
VBAT_EN: Q1.1(B)
VDD_EXT: C32.2 C33.2 R20.1 U4.7(VDD_EXT) U7.2(VCCA)
VDD_MCU: C34.2 U7.19(VCCB)
4G_ON/OFF: U1.66(PC9)
4G_RESET: U1.61(PD14)
4G_RXD: U1.64(PC7)
4G_STATUS: U1.65(PC8)
4G_TXD: U1.63(PC6)
4G_W_DISABLE#: U1.60(PD13)
4G_WAKEUP_IN: U1.62(PD15)
ANT_GNSS: U4.47(ANT_GNSS)
ANT_MAIN: U4.49(ANT_MAIN)
AP_READY: U4.2(AP_READY)
BOOT0: H1.1 R1.1 U1.94(BOOT0)
BOOT1: R2.1 U1.37(PB2-BOOT1(PB2))
CC1: R4.1 USB1.A5(CC1)
CC2: R3.2 USB1.B5(CC2)
CTS_MCU: U7.13(B7)
DBG_RXD: U4.11(DBG_RXD)
DBG_TXD: U4.12(DBG_TXD)
DC_5V: C16.1 C17.2 LED1.1(A) LED2.1(A) LED3.1(A) R13.2 U6.2(IN)
DCD_MCU: U7.18(B2)
DTR_MCU: U7.14(B6)
IIC_SCL: R6.2 U1.47(PB10) U3.6(SCL)
IIC_SDA: R5.2 U1.48(PB11) U3.5(SDA)
IIC_WP: R7.2 U1.46(PE15) U3.7(WP)
MAIN_CTS: U7.8(A7)
MAIN_DCD: U7.3(A2)
MAIN_DTR: U7.7(A6)
MAIN_RI: U7.6(A5)
MAIN_RTS: U7.9(A8)
MAIN_RXD: U4.68(RXD) U7.5(A4)
MAIN_TXD: U4.67(TXD) U7.4(A3)
NET_MODE: Q7.1(B) U4.5(NET_MODE)
NET_STATUS: Q8.1(B) U4.6(NET_STATUS)
NRST: C7.2 SW1.1 U1.14(NRST)
ON/OFF_MCU: Q2.1(B)
OSC_IN: C2.2 U1.12(PH0-OSC_IN(PH0)) X1.1(OSC1)
OSC_OUT: C1.2 U1.13(PH1-OSC_OUT(PH1)) X1.2(OSC2)
PWRKEY: C28.2 Q2.3(C) U4.21(PWRKEY)
RESET_MCU: Q4.1(B)
RESET_N: C30.2 Q4.3(C) U4.20(RESET_N)
RI_MCU: U7.15(B5)
RTS_MCU: U7.12(B8)
RXD_MCU: U7.17(B3)
STATUS: Q6.1(B) U4.61(STATUS)
SWCLK: H1.5 U1.76(PA14(JTCK-SWCLK))
SWDIO: H1.4 U1.72(PA13(JTMS-SWDIO))
TXD_MCU: U7.16(B4)
UART3_RX: H2.2 U1.56(PD9)
UART3_TX: H2.3 U1.55(PD8)
USB_BOOT: U4.115(USB_BOOT)
USB_DM_TEST: U4.70(USB_DM)
USB_DP_TEST: U4.69(USB_DP)
USB_VBUS: U4.71(USB_VBUS)
USIM_CLK: R9.1 U4.16(USIM_CLK)
USIM_DATA: R10.1 U4.15(USIM_DATA)
USIM_GND: C15.2 CARD1.5(GND) U4.10(USIM_GND)
USIM_RST: R8.1 U4.17(USIM_RST)
USIM_VDD: C15.1 CARD1.1(VCC) R11.1 U4.14(USIM_VDD) U5.1
VCAP1: C3.1 U1.49(VCAP_1)
VCAP2: C4.1 U1.73(VCAP_2)
W_DISABLE#: U4.4(W_DISABLE#)
W_DISABLE#_R: C31.2 Q5.3(C)
W_DISABLE_MCU: Q5.1(B)
WAKEUP_IN: U4.1(WAKEUP_IN)
WAKEUP_IN_MCU: Q3.1(B)
WAKEUP_IN_R: C29.2 Q3.3(C)
WIFI_ANT: U4.35(WIFI_ANT)
Net-(C12-2): C12.2 CARD1.2(RST) R8.2 U5.5
Net-(C13-2): C13.2 CARD1.3(CLK) R9.2 U5.4
Net-(C14-2): C14.2 CARD1.7(I/O) R10.2 R11.2 U5.6
Net-(LED1-2): LED1.2(K) R17.2
Net-(LED2-2): LED2.2(K) R18.2
Net-(LED3-2): LED3.2(K) R19.2
Net-(Q1-3): Q1.3(C) R13.1 U6.1(EN)
Net-(Q6-3): Q6.3(C) R17.1
Net-(Q7-3): Q7.3(C) R18.1
Net-(Q8-3): Q8.3(C) R19.1
Net-(R12-1): R12.1 R16.2 U6.5(ADJ)
Net-(R20-2): R20.2 R21.2 U7.10(OE)

Not connected (* = marked no-connect by the designer): CARD1 6(VPP); U1 1(PE2) 2(PE3) 3(PE4) 4(PE5) 5(PE6) 7(PC13) 8(PC14-OSC32_IN(PC14)) 9(PC15-OSC32_OUT(PC15)) 15(PC0) 16(PC1) 17(PC2) 18(PC3) 23(PA0-WKUP(PA0)) 24(PA1) 25(PA2) 26(PA3) 29(PA4) 30(PA5) 31(PA6) 32(PA7) 33(PC4) 34(PC5) 35(PB0) 36(PB1) 38(PE7) 39(PE8) 40(PE9) 41(PE10) 42(PE11) 43(PE12) 44(PE13) 45(PE14) 51(PB12) 52(PB13) 53(PB14) 54(PB15) 57(PD10) 58(PD11) 59(PD12) 67(PA8) 68(PA9) 69(PA10) 70(PA11) 71(PA12) 77(PA15(JTDI)) 78(PC10) 79(PC11) 80(PC12) 81(PD0) 82(PD1) 83(PD2) 84(PD3) 85(PD4) 86(PD5) 87(PD6) 88(PD7) 89(PB3(JTDOTRACESWO)) 90(PB4(NJTRST)) 91(PB5) 92(PB6) 93(PB7) 95(PB8) 96(PB9) 97(PE0) 98(PE1); U4 3(SLEEP_IND) 13(USIM_PRESENCE) 18(NC)* 23(SD_DET) 24(PCM_IN) 25(PCM_OUT) 26(PCM_SYNC) 27(PCM_CLK) 28(SDC2_DATA_3) 29(SDC2_DATA_2) 30(SDC2_DATA_1) 31(SDC2_DATA_0) 32(SDC2_CLK) 33(SDC2_CMD) 34(VDD_SDIO) 37(SPI_CS_N) 38(SPI_MOSI) 39(SPI_MISO) 40(SPI_CLK) 41(I2C_SCL) 42(I2C_SDA) 43(ADC2) 44(ADC1) 45(ADC0) 55(NC)* 62(RI*) 63(DCD*) 64(RTS) 65(CTS) 66(DTR*) 73(SPK_P) 74(SPK_N) 75(MIC_P) 77(MIC_N) 78(KEYIN1) 79(KEYIN2) 80(KEYIN3) 81(KEYIN4) 82(KEYIN5) 83(KEYOUT0) 84(KEYOUT1) 113(KEYOUT2) 114(KEYOUT3) 116(NC)* 117(CLK26M_OUT) 118(NC)* 119(LCD_FMARK) 120(LCD_RSTB) 121(SPILCD_SEL) 122(SPILCD_CS) 123(SPILCD_CLK) 124(SPILCD_SDC) 125(SPILCD_SI/O) 126(GPIO1) 127(PM_EN_WLAN) 128(NC)* 129(SD1_DATA3) 130(SD1_DATA2) 131(SD1_DATA1) 132(SD1_DATA0) 133(SD1_CLK) 134(SD1_CMD) 135(WAKE_WLAN) 136(WLAN_EN) 137(UART3_RXD) 138(UART3_TXD) 139(BT_EN) 140(NC)* 141(I2C2_SCL) 142(I2C2_SDA) 143(RFCTL_1) 144(RFCTL_2); U5 3

## Notes on the sheets
sheet 2
- TYPEC
- 5V转3.3V
- MCU重启电路
- EEPROM
- SWD

# Board PCB1
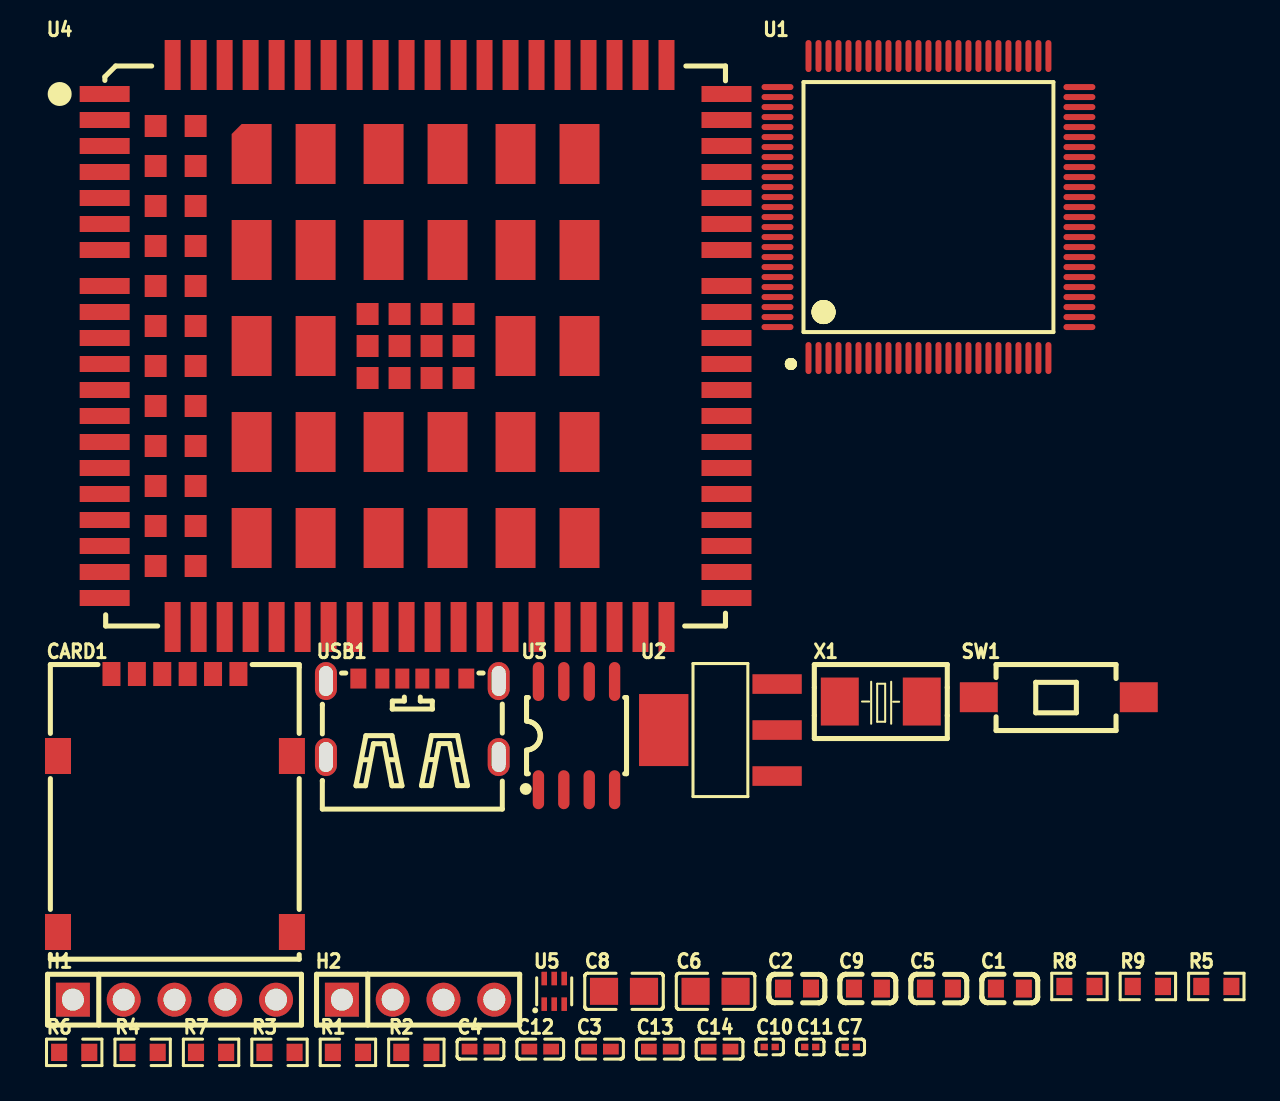
[diagram p4: board, top side]
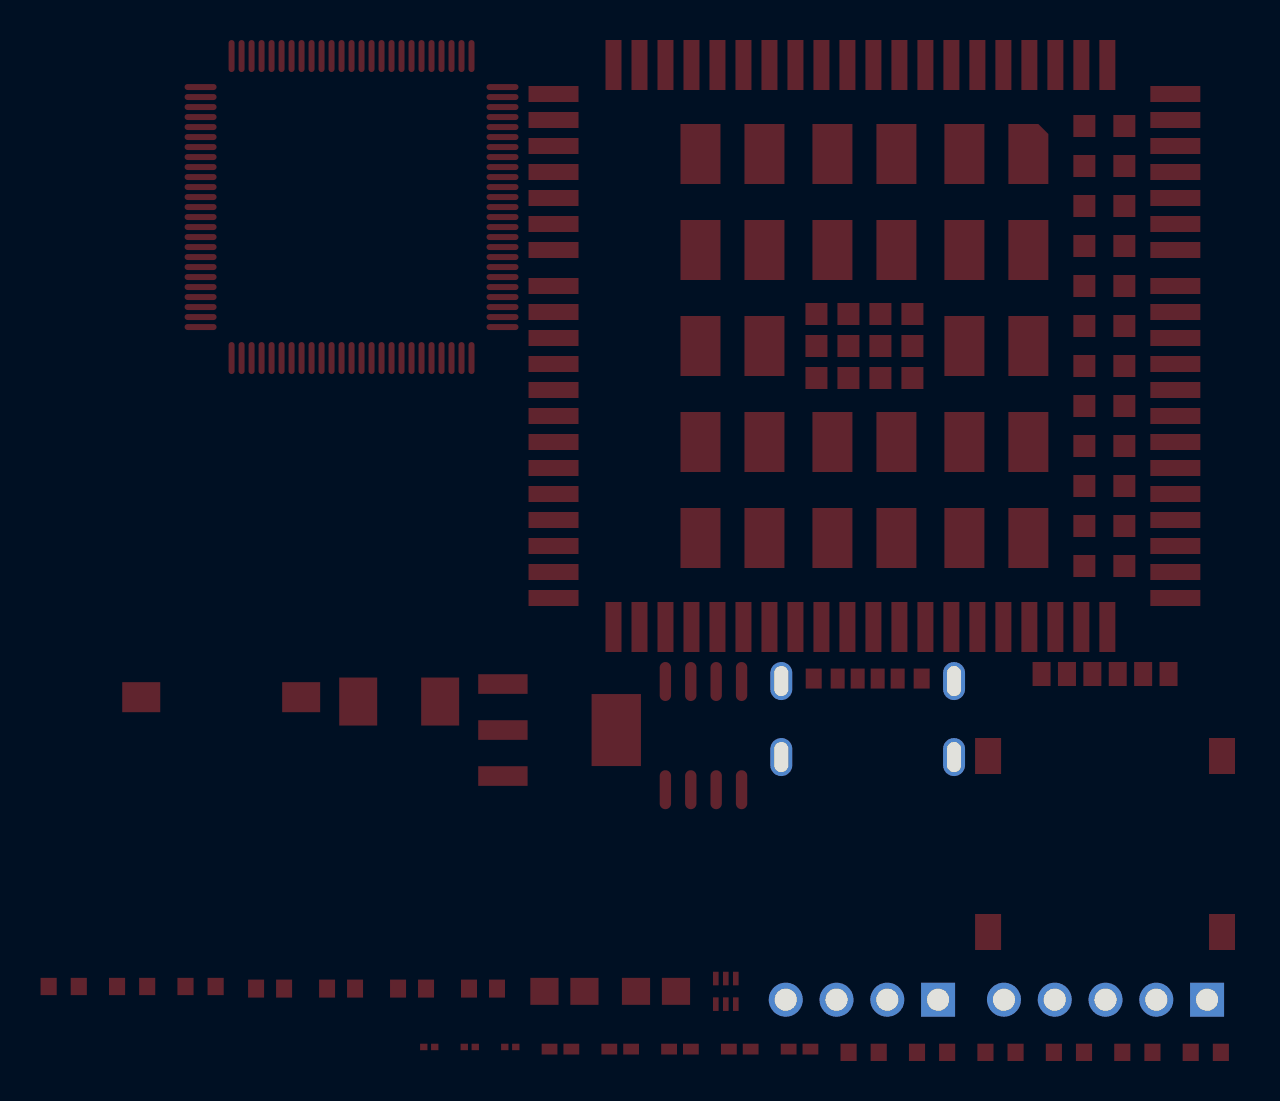
[diagram p5: board, bottom side, seen from below]

No outline. copper layers: Top Layer, Bottom Layer. Coordinates in mm from the lowest, leftmost part position.
Stack: Top Layer 0.035mm / Dielectric1 1.51mm FR4 er 4.5 / Bottom Layer 0.035mm

## Design rules (mm)
template: JLCPCB Capability(Two Layers Board)
spacing copperThickness1oz (default): track to track 0.102, other pairs 0.152 to 0.3
spacing copperThickness2oz: track to track 0.203, other pairs 0.152 to 0.3
track width copperThickness1oz (default): min 0.127, default 0.254, max 2.54
track width copperThickness2oz: min 0.203, default 0.254, max 2.54
differential pair differentialPair (default): width min 0.127, default 0.254, max 2.54; gap min 0.152, default 0.152
via viaSize (default): diameter min 0.5, default 0.61, max 10; hole min 0.3, default 0.305, max 6.3

## Placement (name value [footprint] x y rotation side)
C1  22pF  [C0603]  46.8 3.19 0 top
C2  22pF  [C0603]  36.15 3.19 0 top
C3  2.2uF  [C0402]  26.3 0.16 0 top
C4  2.2uF  [C0402]  20.32 0.16 0 top
C5  100nF  [C0603]  43.25 3.19 0 top
C6  10uF  [C0805]  32.08 3.05 0 top
C7  100nF  [C0201]  38.84 0.27 0 top
C8  10uF  [C0805]  27.5 3.05 0 top
C9  100nF  [C0603]  39.7 3.19 0 top
C10  100nF  [C0201]  34.79 0.27 0 top
C11  100nF  [C0201]  36.81 0.27 0 top
C12  33pF  [C0402]  23.31 0.16 0 top
C13  33pF  [C0402]  29.29 0.16 0 top
C14  33pF  [C0402]  32.28 0.16 0 top
CARD1  SMN-305-ARP7  [NANO-SIM-SMD_SMN-305-ARP7]  5.04 12.47 0 top
H1  PZ254V-11-05P  [HDR-TH_5P-P2.54-V-M]  5.02 2.63 0 top
H2  PZ254V-11-04P  [HDR-TH_4P-P2.54-V-M]  17.2 2.63 0 top
R1  10kΩ  [R0603]  13.69 0 0 top
R2  10kΩ  [R0603]  17.11 0 0 top
R3  5.1kΩ  [R0603]  10.27 0 0 top
R4  5.1kΩ  [R0603]  3.42 0 0 top
R5  10kΩ  [R0603]  57.12 3.29 0 top
R6  10kΩ  [R0603]  0 0 0 top
R7  10kΩ  [R0603]  6.85 0 0 top
R8  0Ω  [R0603]  50.28 3.29 0 top
R9  0Ω  [R0603]  53.7 3.29 0 top
SW1  TS-1101-C-W  [SW-SMD_L6.0-W3.3-LS8.0]  49.24 17.76 0 top
U1  stm32f407  [LQFP-100_L14.0-W14.0-P0.50-LS16.0-BL]  42.73 42.27 0 top
U2  AMS1117-3.3  [SOT-223-4_L6.5-W3.5-P2.30-LS7.0-BR]  32.32 16.12 0 top
U3  AT24C32D-SSHM-T  [SOIC-8_L5.0-W4.0-P1.27-LS6.0-BL]  25.12 15.84 0 top
U4  EC200UCNLA-N05-SGNSA  [LCC-LGA-144_L31.0-W28.0-P1.30_L610-CN-02]  17.07 35.32 0 top
U5  ESDA6V8AV6  [SOT-563-6_L1.6-W1.2-P0.50-LS1.6-BL]  24.01 3.05 0 top
USB1  TYPE-C 6P(073)  [TYPE-C-SMD_TYPE-C-6P]  16.91 16.73 0 top
X1  8MHz  [CRYSTAL-SMD_L5.0-W3.2]  40.34 17.54 0 top

## Footprints (pads in the part's own frame, mm; a bottom-side part is the same pattern mirrored in y, then rotated)
C0201
  rect 0.368x0.324 smd: 1(-0.275,0) 2(0.275,0)
C0402
  rect 0.79x0.54 smd: 1(-0.545,0) 2(0.545,0)
C0603
  rect 0.8x0.9 smd: 1(-0.7,0) 2(0.7,0)
C0805
  rect 1.41x1.35 smd: 1(-1,0) 2(1,0)
CRYSTAL-SMD_L5.0-W3.2
  rect 1.9x2.4 smd: 1(-2.05,0) 2(2.05,0)
HDR-TH_4P-P2.54-V-M
  rect 1.7x1.7 hole 1.1: 1(-3.81,0)
  round 1.7 hole 1.1: 2(-1.27,0) 3(1.27,0) 4(3.81,0)
HDR-TH_5P-P2.54-V-M
  rect 1.7x1.7 hole 1.1: 1(-5.08,0)
  round 1.7 hole 1.1: 2(-2.54,0) 3(0,0) 4(2.54,0) 5(5.08,0)
LCC-LGA-144_L31.0-W28.0-P1.30_L610-CN-02
  rect 2.5x0.8 smd: 1(-15.55,12.6) 2(-15.55,11.3) 3(-15.55,10) 4(-15.55,8.7) 5(-15.55,7.4) 6(-15.55,6.1) 7(-15.55,4.8) 8(-15.55,0.4) 9(-15.55,-0.9) 10(-15.55,-2.2) 11(-15.55,-3.5) 12(-15.55,-4.8) 13(-15.55,-6.1) 14(-15.55,-7.4) 15(-15.55,-8.7) 16(-15.55,-10) 17(-15.55,-11.3) 18(-15.55,-12.6) 37(15.55,-12.6) 38(15.55,-11.3) 39(15.55,-10) 40(15.55,-8.7) 41(15.55,-7.4) 42(15.55,-6.1) 43(15.55,-4.8) 44(15.55,-3.5) 45(15.55,-2.2) 46(15.55,-0.9) 47(15.55,0.4) 48(15.55,4.8) 49(15.55,6.1) 50(15.55,7.4) 51(15.55,8.7) 52(15.55,10) 53(15.55,11.3) 54(15.55,12.6) 141(-15.55,3) 142(-15.55,1.7) 143(15.55,1.7) 144(15.55,3)
  rect 0.8x2.5 smd: 19(-9.55,-14.05) 20(-8.25,-14.05) 21(-6.95,-14.05) 22(-5.65,-14.05) 23(-4.35,-14.05) 24(-3.05,-14.05) 25(-1.75,-14.05) 26(-0.45,-14.05) 27(0.85,-14.05) 28(2.15,-14.05) 29(3.45,-14.05) 30(4.75,-14.05) 31(6.05,-14.05) 32(7.35,-14.05) 33(8.65,-14.05) 34(9.95,-14.05) 35(11.25,-14.05) 36(12.55,-14.05) 55(12.55,14.05) 56(11.25,14.05) 57(9.95,14.05) 58(8.65,14.05) 59(7.35,14.05) 60(6.05,14.05) 61(4.75,14.05) 62(3.45,14.05) 63(2.15,14.05) 64(0.85,14.05) 65(-0.45,14.05) 66(-1.75,14.05) 67(-3.05,14.05) 68(-4.35,14.05) 69(-5.65,14.05) 70(-6.95,14.05) 71(-8.25,14.05) 72(-9.55,14.05) 113(-10.85,14.05) 114(-12.15,14.05) 115(-10.85,-14.05) 116(-12.15,-14.05)
  rect 1.1x1.1 smd: 73(2.4,1.6) 74(2.4,0) 75(2.4,-1.6) 76(0.8,1.6) 77(0.8,0) 78(0.8,-1.6) 79(-0.8,1.6) 80(-0.8,0) 81(-0.8,-1.6) 82(-2.4,1.6) 83(-2.4,0) 84(-2.4,-1.6) 117(-11,11) 118(-11,9) 119(-11,7) 120(-11,5) 121(-11,3) 122(-11,1) 123(-11,-1) 124(-11,-3) 125(-11,-5) 126(-11,-7) 127(-11,-9) 128(-11,-11) 129(-13,11) 130(-13,9) 131(-13,7) 132(-13,5) 133(-13,3) 134(-13,1) 135(-13,-1) 136(-13,-3) 137(-13,-5) 138(-13,-7) 139(-13,-9) 140(-13,-11)
  rect 2x3 smd: 85(8.2,9.6) 86(8.2,4.8) 87(8.2,0) 88(8.2,-4.8) 89(8.2,-9.6) 90(5,9.6) 91(5,4.8) 92(5,0) 93(5,-4.8) 94(5,-9.6) 95(1.6,9.6) 96(1.6,4.8) 97(1.6,-4.8) 98(1.6,-9.6) 99(-1.6,9.6) 100(-1.6,4.8) 101(-1.6,-4.8) 102(-1.6,-9.6) 103(-5,9.6) 104(-5,4.8) 105(-5,0) 106(-5,-4.8) 107(-5,-9.6) 109(-8.2,4.8) 110(-8.2,0) 111(-8.2,-4.8) 112(-8.2,-9.6)
  custom 2x3 smd: 108(-8.2,9.6)
LQFP-100_L14.0-W14.0-P0.50-LS16.0-BL
  oval 0.3x1.6 smd: 1(-6,-7.55) 2(-5.5,-7.55) 3(-5,-7.55) 4(-4.5,-7.55) 5(-4,-7.55) 6(-3.5,-7.55) 7(-3,-7.55) 8(-2.5,-7.55) 9(-2,-7.55) 10(-1.5,-7.55) 11(-1,-7.55) 12(-0.5,-7.55) 13(0,-7.55) 14(0.5,-7.55) 15(1,-7.55) 16(1.5,-7.55) 17(2,-7.55) 18(2.5,-7.55) 19(3,-7.55) 20(3.5,-7.55) 21(4,-7.55) 22(4.5,-7.55) 23(5,-7.55) 24(5.5,-7.55) 25(6,-7.55) 51(6,7.55) 52(5.5,7.55) 53(5,7.55) 54(4.5,7.55) 55(4,7.55) 56(3.5,7.55) 57(3,7.55) 58(2.5,7.55) 59(2,7.55) 60(1.5,7.55) 61(1,7.55) 62(0.5,7.55) 63(0,7.55) 64(-0.5,7.55) 65(-1,7.55) 66(-1.5,7.55) 67(-2,7.55) 68(-2.5,7.55) 69(-3,7.55) 70(-3.5,7.55) 71(-4,7.55) 72(-4.5,7.55) 73(-5,7.55) 74(-5.5,7.55) 75(-6,7.55)
  oval 1.6x0.3 smd: 26(7.55,-6) 27(7.55,-5.5) 28(7.55,-5) 29(7.55,-4.5) 30(7.55,-4) 31(7.55,-3.5) 32(7.55,-3) 33(7.55,-2.5) 34(7.55,-2) 35(7.55,-1.5) 36(7.55,-1) 37(7.55,-0.5) 38(7.55,0) 39(7.55,0.5) 40(7.55,1) 41(7.55,1.5) 42(7.55,2) 43(7.55,2.5) 44(7.55,3) 45(7.55,3.5) 46(7.55,4) 47(7.55,4.5) 48(7.55,5) 49(7.55,5.5) 50(7.55,6) 76(-7.55,6) 77(-7.55,5.5) 78(-7.55,5) 79(-7.55,4.5) 80(-7.55,4) 81(-7.55,3.5) 82(-7.55,3) 83(-7.55,2.5) 84(-7.55,2) 85(-7.55,1.5) 86(-7.55,1) 87(-7.55,0.5) 88(-7.55,0) 89(-7.55,-0.5) 90(-7.55,-1) 91(-7.55,-1.5) 92(-7.55,-2) 93(-7.55,-2.5) 94(-7.55,-3) 95(-7.55,-3.5) 96(-7.55,-4) 97(-7.55,-4.5) 98(-7.55,-5) 99(-7.55,-5.5) 100(-7.55,-6)
NANO-SIM-SMD_SMN-305-ARP7
  rect 0.9x1.2 smd: 1(-3.175,6.45) 2(-0.635,6.45) 3(1.905,6.45) 5(-1.905,6.45) 6(0.635,6.45) 7(3.175,6.45)
  rect 1.3x1.8 smd: 8(-5.85,-6.45) 9(-5.85,2.35) 10(5.85,2.35) 11(5.85,-6.45)
R0603
  rect 0.806x0.864 smd: 1(-0.753,0) 2(0.753,0)
SOIC-8_L5.0-W4.0-P1.27-LS6.0-BL
  oval 0.569x1.95 smd: 1(-1.905,-2.705) 2(-0.635,-2.705) 3(0.635,-2.705) 4(1.905,-2.705) 5(1.905,2.705) 6(0.635,2.705) 7(-0.635,2.705) 8(-1.905,2.705)
SOT-223-4_L6.5-W3.5-P2.30-LS7.0-BR
  rect 2.47x0.98 smd: 1(2.835,-2.3) 2(2.835,0) 3(2.835,2.3)
  rect 2.47x3.6 smd: 4(-2.835,0)
SOT-563-6_L1.6-W1.2-P0.50-LS1.6-BL
  rect 0.28x0.68 smd: 1(-0.5,-0.64) 2(0,-0.64) 3(0.5,-0.64) 4(0.5,0.64) 5(0,0.64) 6(-0.5,0.64)
SW-SMD_L6.0-W3.3-LS8.0
  rect 1.9x1.5 smd: 1(-4,0) 2(4,0)
TYPE-C-SMD_TYPE-C-6P
  oval 1.1x1.9 hole 0.7x1.5: 7(-4.32,1.837) 7(-4.32,-1.962) 7(4.32,1.837) 7(4.32,-1.962)
  rect 0.7x1 smd: A5(-0.5,1.962) A9(1.5,1.962) B5(0.5,1.962) B9(-1.5,1.962)
  rect 0.8x1 smd: A12(2.7,1.962) B12(-2.7,1.962)

## Nets
As in the schematic, except:
GND: C1.1 C2.1 C3.2 C4.2 C5.2 C6.2 C7.1 C8.2 C9.2 C10.1 C11.1 CARD1.9 CARD1.10 CARD1.11 H1.3 H2.4 R1.2 R2.2 R3.1 R4.2 SW1.2 U1.10 U1.20 U1.27 U1.74 U1.99 U2.1 U3.1 U3.2 U3.3 U3.4 U4.8 U4.9 U4.19 U4.22 U4.36 U4.46 U4.48 U4.50 U4.51 U4.52 U4.53 U4.54 U4.56 U4.72 U4.76 U4.85 U4.86 U4.87 U4.88 U4.89 U4.90 U4.91 U4.92 U4.93 U4.94 U4.95 U4.96 U4.97 U4.98 U4.99 U4.100 U4.101 U4.102 U4.103 U4.104 U4.105 U4.106 U4.107 U4.108 U4.109 U4.110 U4.111 U4.112 USB1.7 USB1.A12 USB1.B12
USIM_CLK: R9.1
USIM_RST: R8.1
$5N1589: CARD1.2 R8.2

Pads without a net: C12 1 2; C13 1 2; C14 1 2; CARD1 1 3 5 6 7 8; R9 2; U1 1 2 3 4 5 7 8 9 15 16 17 18 23 24 25 26 29 30 31 32 33 34 35 36 38 39 40 41 42 43 44 45 51 52 53 54 57 58 59 60 61 62 63 64 65 66 67 68 69 70 71 77 78 79 80 81 82 83 84 85 86 87 88 89 90 91 92 93 95 96 97 98; U4 1 2 3 4 5 6 7 10 11 12 13 14 15 16 17 18 20 21 23 24 25 26 27 28 29 30 31 32 33 34 35 37 38 39 40 41 42 43 44 45 47 49 55 57 58 59 60 61 62 63 64 65 66 67 68 69 70 71 73 74 75 77 78 79 80 81 82 83 84 113 114 115 116 117 118 119 120 121 122 123 124 125 126 127 128 129 130 131 132 133 134 135 136 137 138 139 140 141 142 143 144; U5 1 2 3 4 5 6
